# EAGLE board udisk (EAGLE 4.16), part 1 of 2
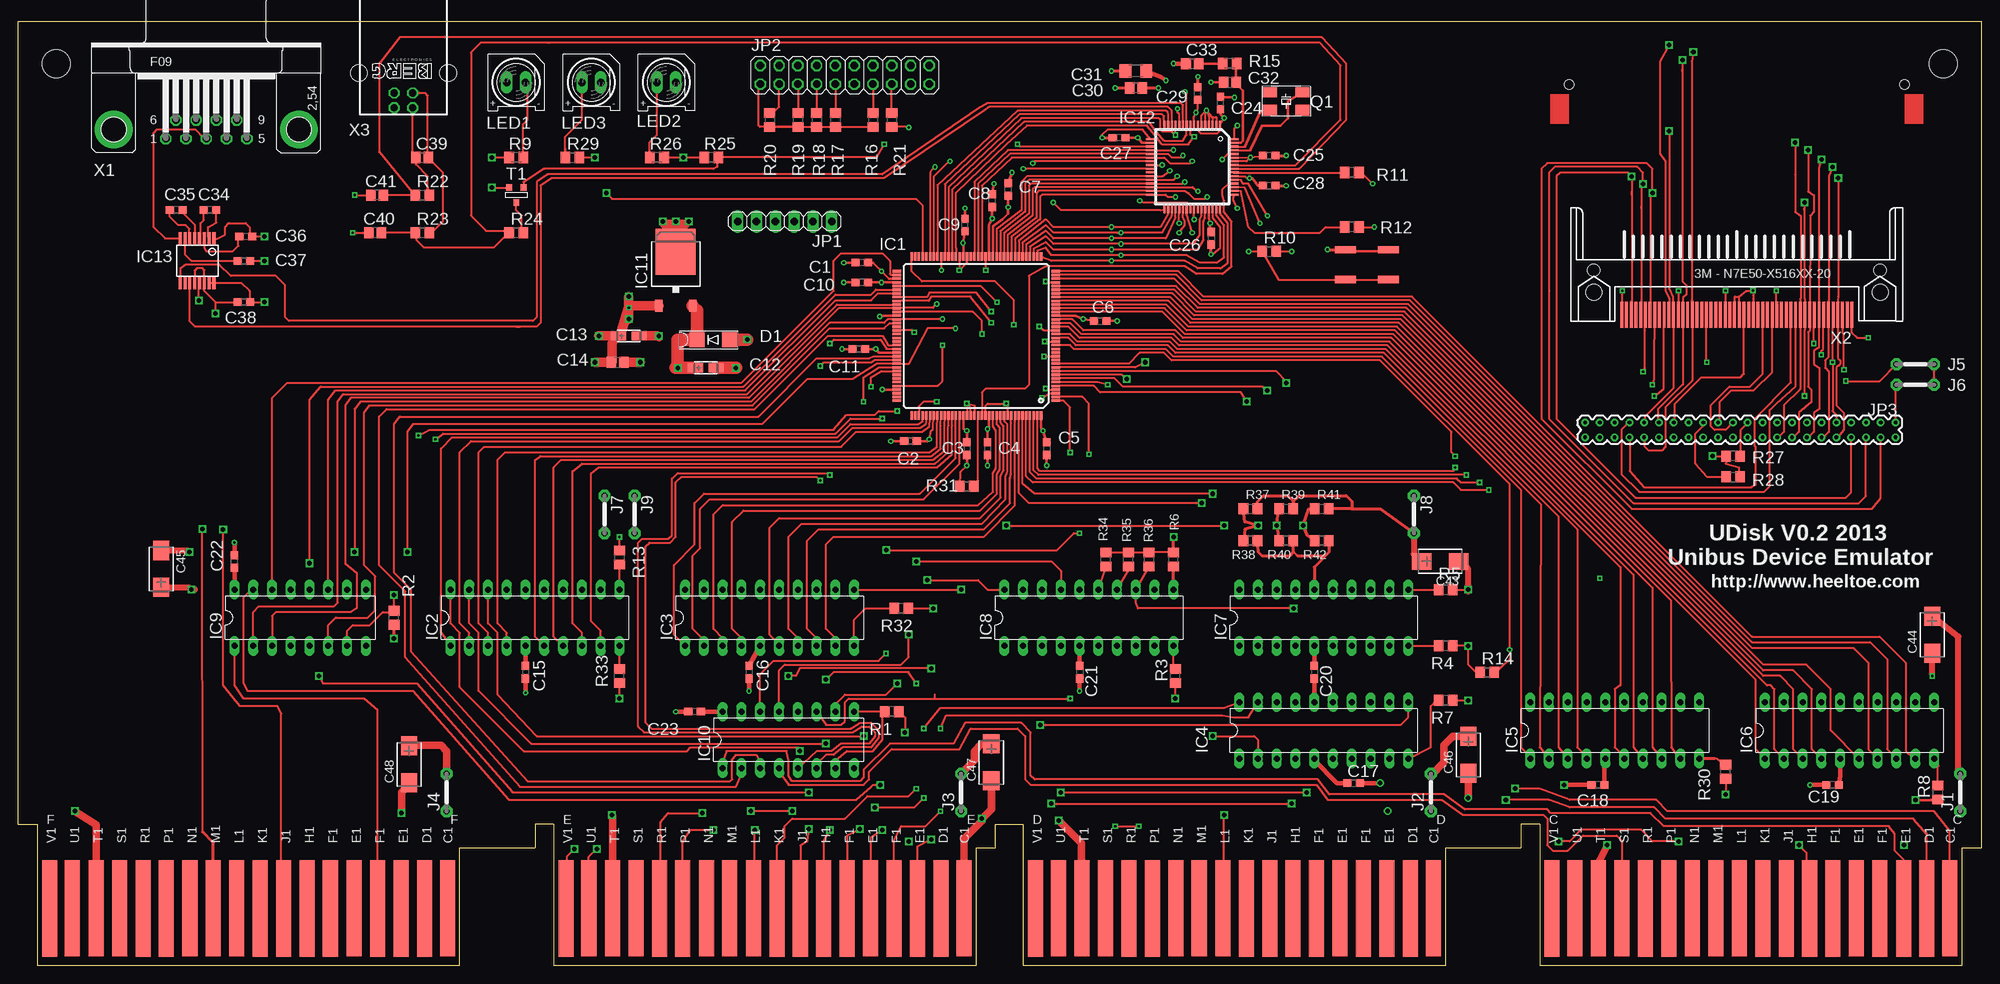
[diagram p7: board, top side]
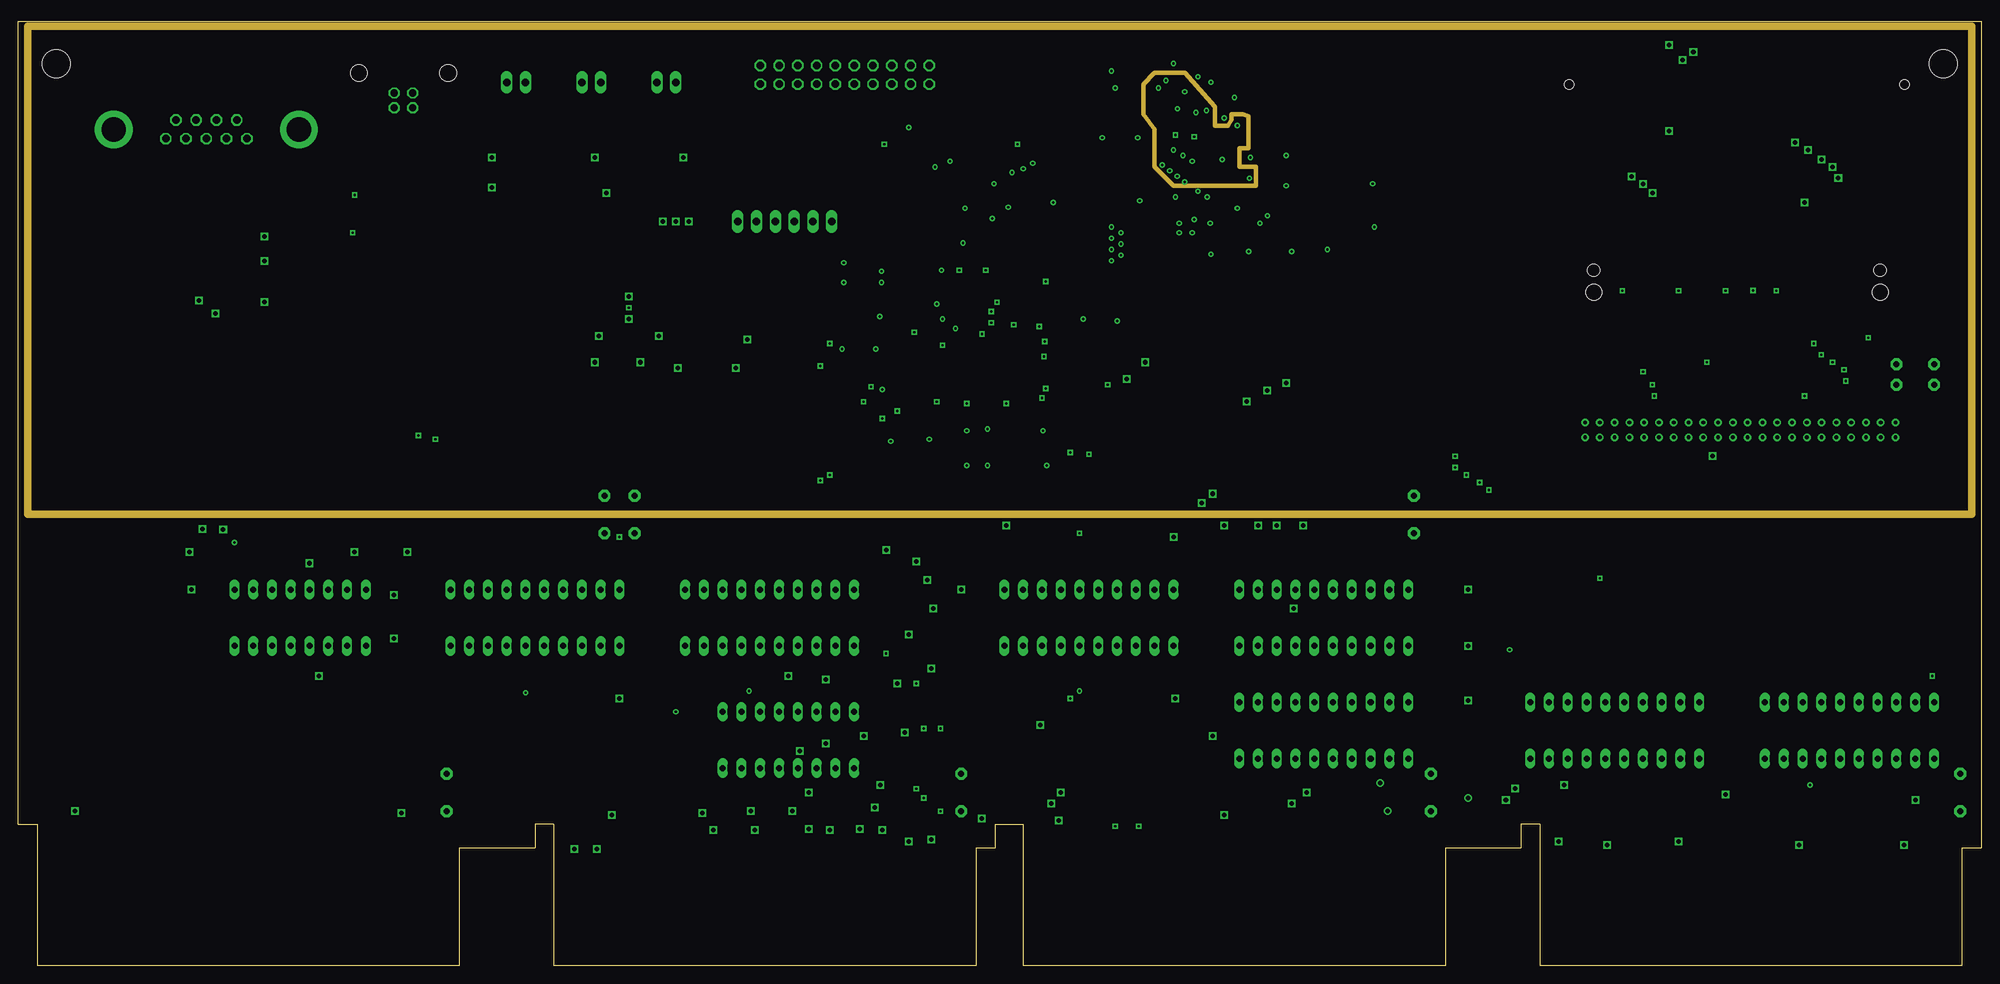
[diagram p8: board, inner layer $+5V]
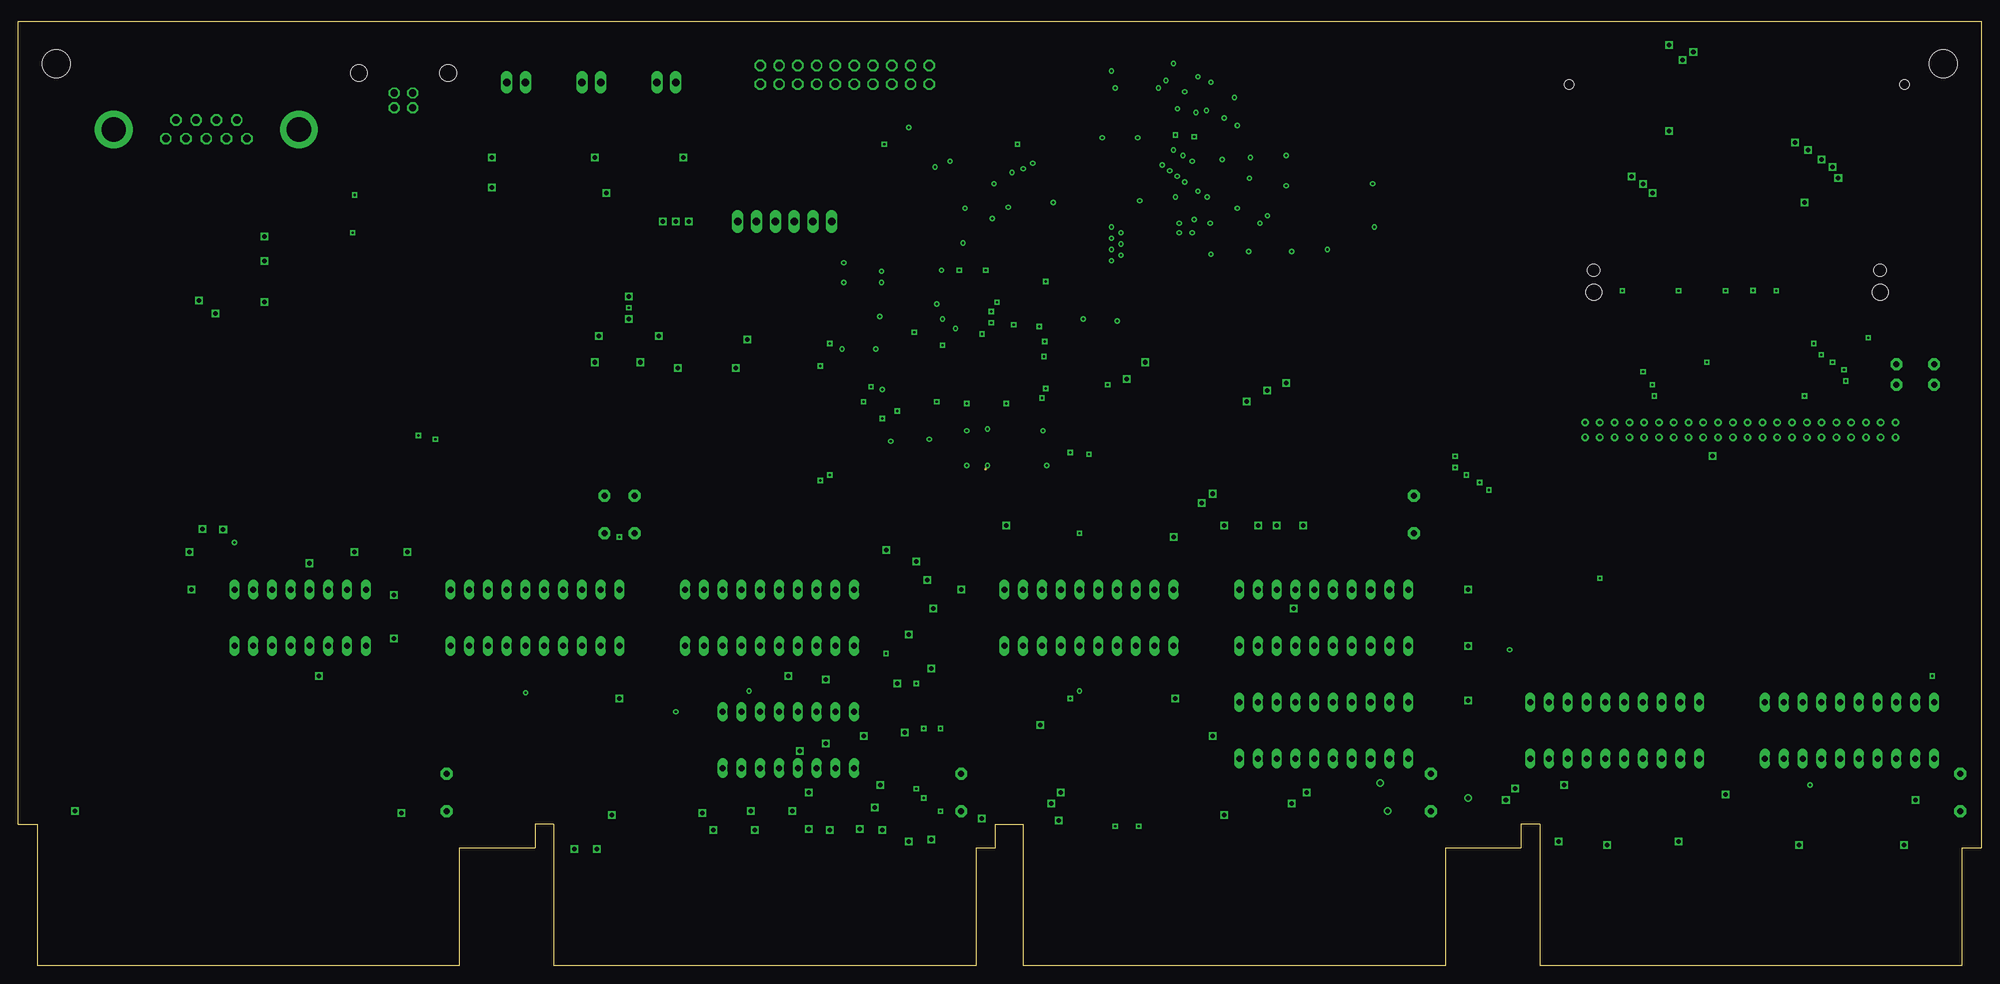
[diagram p9: board, inner layer $GND]
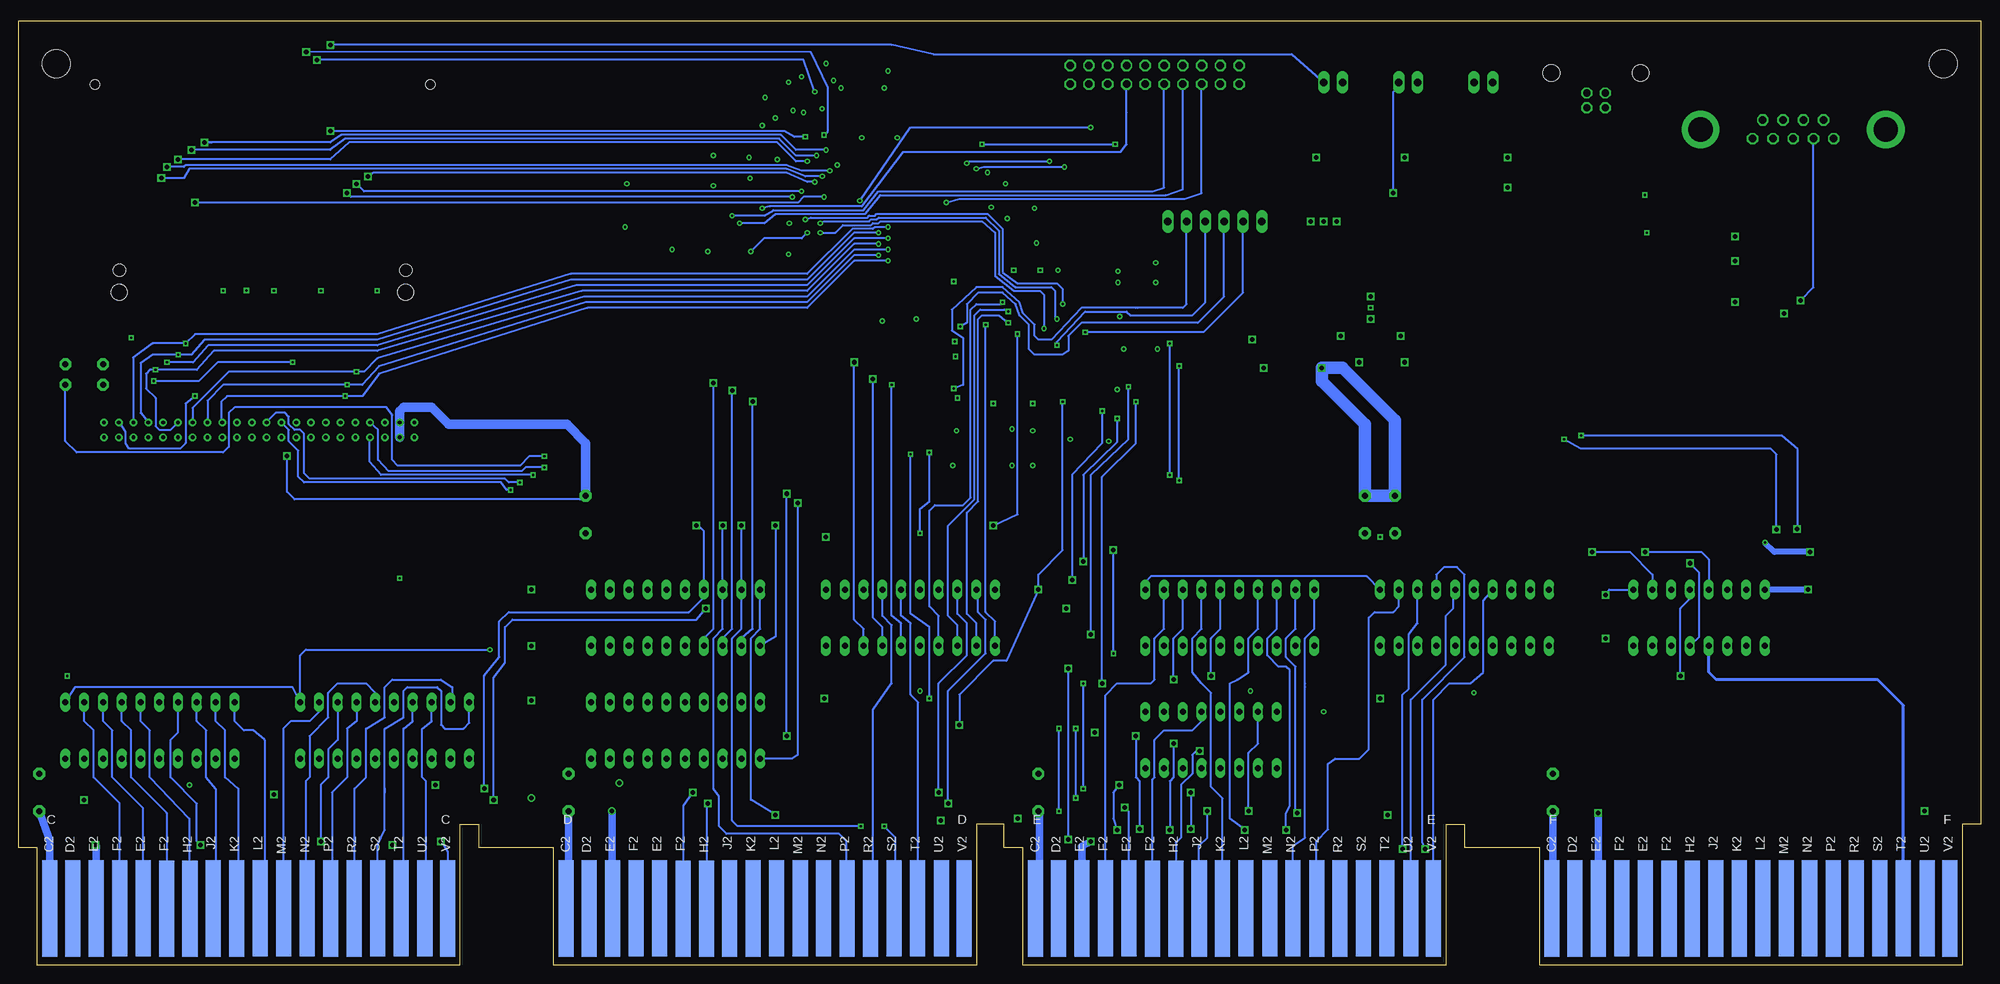
[diagram p10: board, bottom side, seen from below]

Size 265.43 x 127.64 mm. Coordinates in mm from the lower left corner, seen from the top.
Outline: 69.85,15.88 59.69,15.88 59.69,0 2.54,0 2.54,19.05 0,19.05 0,127.64 265.43,127.64 265.43,15.88 262.89,15.88 262.89,0 205.74,0 205.74,19.05 203.2,19.05 203.2,15.88 193.04,15.88 193.04,0 135.89,0 135.89,19.05 132.13,19.05 132.13,15.88 129.54,15.88 129.54,0 72.39,0 72.39,19.05 69.9,19.05 69.9,15.88
Copper layers (1+2*3*4+15+16): Top 0.0356mm / dielectric 0.2007mm / $+5V 0.0356mm / dielectric 0mm / $+3V3 0.0356mm / dielectric 0mm / $vddcore 0.0356mm / dielectric 0.2007mm / $GND 0.0356mm / dielectric 0.2007mm / Bottom 0.0356mm
Design rules "default": minimum track width 10mil, minimum drill 10mil, track to track 7mil, track to pad 6mil, pad to pad 5mil, via to via 7mil, smd to smd 5mil, copper to edge 25mil, drill to drill 8mil, minimum pad ring 10mil, minimum via ring 8mil, stop-mask expansion 4mil, vias tented up to drill 0mil, thermal gap 10mil
Holes 3.81 mm at 5.08,121.92 260.35,121.92

## Footprints (pad centres in the part's own frame; a part is rotated, then mirrored left to right if it is on the bottom)
C0603 = smd 1.1 x 1: 1 -0.85,0; 2 0.85,0
CT3216 = smd 2 x 1.2: + 1.4,0; - -1.4,0
C0805 = smd 1.3 x 1.5: 1 -0.85,0; 2 0.85,0
C1206 = smd 1.6 x 1.8: 1 -1.4,0; 2 1.4,0
CT6032 = smd 2.6 x 2.2: + 2.5,0; - -2.5,0
SMA = smd 2 x 2: 1 -2.2,0; 2 2.2,0
TQ144 = smd 1.2 x 0.35: 1 -10.75,8.75; 2 -10.75,8.25; 3 -10.75,7.75; 4 -10.75,7.25; 5 -10.75,6.75; 6 -10.75,6.25; 7 -10.75,5.75; 8 -10.75,5.25; 9 -10.75,4.75; 10 -10.75,4.25; 11 -10.75,3.75; 12 -10.75,3.25; 13 -10.75,2.75; 14 -10.75,2.25; 15 -10.75,1.75; 16 -10.75,1.25; 17 -10.75,0.75; 18 -10.75,0.25; 19 -10.75,-0.25; 20 -10.75,-0.75; 21 -10.75,-1.25; 22 -10.75,-1.75; 23 -10.75,-2.25; 24 -10.75,-2.75; 25 -10.75,-3.25; 26 -10.75,-3.75; 27 -10.75,-4.25; 28 -10.75,-4.75; 29 -10.75,-5.25; 30 -10.75,-5.75; 31 -10.75,-6.25; 32 -10.75,-6.75; 33 -10.75,-7.25; 34 -10.75,-7.75; 35 -10.75,-8.25; 36 -10.75,-8.75; 73 10.75,-8.75; 74 10.75,-8.25; 75 10.75,-7.75; 76 10.75,-7.25; 77 10.75,-6.75; 78 10.75,-6.25; 79 10.75,-5.75; 80 10.75,-5.25; 81 10.75,-4.75; 82 10.75,-4.25; 83 10.75,-3.75; 84 10.75,-3.25; 85 10.75,-2.75; 86 10.75,-2.25; 87 10.75,-1.75; 88 10.75,-1.25; 89 10.75,-0.75; 90 10.75,-0.25; 91 10.75,0.25; 92 10.75,0.75; 93 10.75,1.25; 94 10.75,1.75; 95 10.75,2.25; 96 10.75,2.75; 97 10.75,3.25; 98 10.75,3.75; 99 10.75,4.25; 100 10.75,4.75; 101 10.75,5.25; 102 10.75,5.75; 103 10.75,6.25; 104 10.75,6.75; 105 10.75,7.25; 106 10.75,7.75; 107 10.75,8.25; 108 10.75,8.75 | smd 0.35 x 1.2: 37 -8.75,-10.75; 38 -8.25,-10.75; 39 -7.75,-10.75; 40 -7.25,-10.75; 41 -6.75,-10.75; 42 -6.25,-10.75; 43 -5.75,-10.75; 44 -5.25,-10.75; 45 -4.75,-10.75; 46 -4.25,-10.75; 47 -3.75,-10.75; 48 -3.25,-10.75; 49 -2.75,-10.75; 50 -2.25,-10.75; 51 -1.75,-10.75; 52 -1.25,-10.75; 53 -0.75,-10.75; 54 -0.25,-10.75; 55 0.25,-10.75; 56 0.75,-10.75; 57 1.25,-10.75; 58 1.75,-10.75; 59 2.25,-10.75; 60 2.75,-10.75; 61 3.25,-10.75; 62 3.75,-10.75; 63 4.25,-10.75; 64 4.75,-10.75; 65 5.25,-10.75; 66 5.75,-10.75; 67 6.25,-10.75; 68 6.75,-10.75; 69 7.25,-10.75; 70 7.75,-10.75; 71 8.25,-10.75; 72 8.75,-10.75; 109 8.75,10.75; 110 8.25,10.75; 111 7.75,10.75; 112 7.25,10.75; 113 6.75,10.75; 114 6.25,10.75; 115 5.75,10.75; 116 5.25,10.75; 117 4.75,10.75; 118 4.25,10.75; 119 3.75,10.75; 120 3.25,10.75; 121 2.75,10.75; 122 2.25,10.75; 123 1.75,10.75; 124 1.25,10.75; 125 0.75,10.75; 126 0.25,10.75; 127 -0.25,10.75; 128 -0.75,10.75; 129 -1.25,10.75; 130 -1.75,10.75; 131 -2.25,10.75; 132 -2.75,10.75; 133 -3.25,10.75; 134 -3.75,10.75; 135 -4.25,10.75; 136 -4.75,10.75; 137 -5.25,10.75; 138 -5.75,10.75; 139 -6.25,10.75; 140 -6.75,10.75; 141 -7.25,10.75; 142 -7.75,10.75; 143 -8.25,10.75; 144 -8.75,10.75
DIL20 = drill 0.813 long: 1 -11.43,-3.81; 2 -8.89,-3.81; 3 -6.35,-3.81; 4 -3.81,-3.81; 5 -1.27,-3.81; 6 1.27,-3.81; 7 3.81,-3.81; 8 6.35,-3.81; 9 8.89,-3.81; 10 11.43,-3.81; 11 11.43,3.81; 12 8.89,3.81; 13 6.35,3.81; 14 3.81,3.81; 15 1.27,3.81; 16 -1.27,3.81; 17 -3.81,3.81; 18 -6.35,3.81; 19 -8.89,3.81; 20 -11.43,3.81
DIL16 = drill 0.813 long: 1 -8.89,-3.81; 2 -6.35,-3.81; 3 -3.81,-3.81; 4 -1.27,-3.81; 5 1.27,-3.81; 6 3.81,-3.81; 7 6.35,-3.81; 8 8.89,-3.81; 9 8.89,3.81; 10 6.35,3.81; 11 3.81,3.81; 12 1.27,3.81; 13 -1.27,3.81; 14 -3.81,3.81; 15 -6.35,3.81; 16 -8.89,3.81
TO252 = smd 1 x 1.6: 1 -2.28,-4.8; 2 2.28,-4.8 | smd 5.4 x 6.2: 3 0,2.5
LQFP64 = smd 1.1 x 0.285: 1 -5.7,3.75; 2 -5.7,3.25; 3 -5.7,2.75; 4 -5.7,2.25; 5 -5.7,1.75; 6 -5.7,1.25; 7 -5.7,0.75; 8 -5.7,0.25; 9 -5.7,-0.25; 10 -5.7,-0.75; 11 -5.7,-1.25; 12 -5.7,-1.75; 13 -5.7,-2.25; 14 -5.7,-2.75; 15 -5.7,-3.25; 16 -5.7,-3.75; 33 5.7,-3.75; 34 5.7,-3.25; 35 5.7,-2.75; 36 5.7,-2.25; 37 5.7,-1.75; 38 5.7,-1.25; 39 5.7,-0.75; 40 5.7,-0.25; 41 5.7,0.25; 42 5.7,0.75; 43 5.7,1.25; 44 5.7,1.75; 45 5.7,2.25; 46 5.7,2.75; 47 5.7,3.25; 48 5.7,3.75 | smd 0.285 x 1.1: 17 -3.75,-5.7; 18 -3.25,-5.7; 19 -2.75,-5.7; 20 -2.25,-5.7; 21 -1.75,-5.7; 22 -1.25,-5.7; 23 -0.75,-5.7; 24 -0.25,-5.7; 25 0.25,-5.7; 26 0.75,-5.7; 27 1.25,-5.7; 28 1.75,-5.7; 29 2.25,-5.7; 30 2.75,-5.7; 31 3.25,-5.7; 32 3.75,-5.7; 49 3.75,5.7; 50 3.25,5.7; 51 2.75,5.7; 52 2.25,5.7; 53 1.75,5.7; 54 1.25,5.7; 55 0.75,5.7; 56 0.25,5.7; 57 -0.25,5.7; 58 -0.75,5.7; 59 -1.25,5.7; 60 -1.75,5.7; 61 -2.25,5.7; 62 -2.75,5.7; 63 -3.25,5.7; 64 -3.75,5.7
TSSOP-16 = smd 0.42 x 1.78: 1 -2.3,-2.975; 2 -1.65,-2.975; 3 -1,-2.975; 4 -0.35,-2.975; 5 0.3,-2.975; 6 0.95,-2.975; 7 1.6,-2.975; 8 2.25,-2.975; 9 2.25,2.975; 10 1.6,2.975; 11 0.95,2.975; 12 0.3,2.975; 13 -0.35,2.975; 14 -1,2.975; 15 -1.65,2.975; 16 -2.3,2.975
05 = drill 0.813 pad 1.6 octagon: 1 -2.54,0; 2 2.54,0
1X06 = drill 1.016 long: 1 -6.35,0; 2 -3.81,0; 3 -1.27,0; 4 1.27,0; 5 3.81,0; 6 6.35,0
2X10 = drill 1.016 octagon: 1 -11.43,-1.27; 2 -11.43,1.27; 3 -8.89,-1.27; 4 -8.89,1.27; 5 -6.35,-1.27; 6 -6.35,1.27; 7 -3.81,-1.27; 8 -3.81,1.27; 9 -1.27,-1.27; 10 -1.27,1.27; 11 1.27,-1.27; 12 1.27,1.27; 13 3.81,-1.27; 14 3.81,1.27; 15 6.35,-1.27; 16 6.35,1.27; 17 8.89,-1.27; 18 8.89,1.27; 19 11.43,-1.27; 20 11.43,1.27
2X22 = drill 0.508 round: 1 -24,-1; 2 -24,1; 3 -22,-1; 4 -22,1; 5 -20,-1; 6 -20,1; 7 -18,-1; 8 -18,1; 9 -16,-1; 10 -16,1; 11 -14,-1; 12 -14,1; 13 -12,-1; 14 -12,1; 15 -10,-1; 16 -10,1; 17 -8,-1; 18 -8,1; 19 -6,-1; 20 -6,1; 21 -4,-1; 22 -4,1; 23 -2,-1; 24 -2,1; 25 0,-1; 26 0,1; 27 2,-1; 28 2,1; 29 4,-1; 30 4,1; 31 6,-1; 32 6,1; 33 8,-1; 34 8,1; 35 10,-1; 36 10,1; 37 12,-1; 38 12,1; 39 14,-1; 40 14,1; 41 16,-1; 42 16,1; 43 18,-1; 44 18,1
Q62902-B156 = drill 1.016 long: A -1.27,0; K 1.27,0
SM406 = smd 1.9 x 1.4: 1 -2.2,-1.2; 2 2.2,-1.2; 3 2.2,1.2; 4 -2.2,1.2
R0805 = smd 1.3 x 1.5: 1 -0.95,0; 2 0.95,0
M0805 = smd 1.3 x 1.6: 1 -0.95,0; 2 0.95,0
KSC241J = smd 2.8 x 1: P1 -2.9,2; P2 2.9,2; P3 -2.9,-2; P4 2.9,-2
SOT-23 = smd 0.787 x 0.889: 1 0.025,-1.016; 2 -0.94,1.016; 3 0.991,1.016
EDGE-CON8 = smd 2.032 x 13.017: CA1 261.223,7.709; CB1 258.118,7.684; CC1 254.956,7.684; CD1 251.765,7.684; CE1 248.59,7.693; CF1 245.389,7.668; CH1 242.24,7.668; CJ1 239.09,7.668; CK1 235.915,7.668; CL1 232.74,7.693; CM1 229.54,7.693; CN1 226.39,7.693; CP1 223.19,7.668; CR1 220.04,7.668; CS1 216.865,7.693; CT1 213.69,7.693; CU1 210.49,7.693; CV1 207.404,7.668; DA1 191.373,7.709; DB1 188.268,7.684; DC1 185.106,7.684; DD1 181.915,7.684; DE1 178.74,7.693; DF1 175.539,7.668; DH1 172.39,7.668; DJ1 169.24,7.668; DK1 166.065,7.668; DL1 162.89,7.693; DM1 159.69,7.693; DN1 156.54,7.693; DP1 153.34,7.668; DR1 150.19,7.668; DS1 147.015,7.693; DT1 143.84,7.693; DU1 140.64,7.693; DV1 137.554,7.668; EA1 127.873,7.709; EB1 124.768,7.684; EC1 121.606,7.684; ED1 118.415,7.684; EE1 115.24,7.693; EF1 112.039,7.668; EH1 108.89,7.668; EJ1 105.74,7.668; EK1 102.565,7.668; EL1 99.39,7.693; EM1 96.19,7.693; EN1 93.04,7.693; EP1 89.84,7.668; ER1 86.69,7.668; ES1 83.515,7.693; ET1 80.34,7.693; EU1 77.14,7.693; EV1 74.054,7.668; FA1 58.023,7.709; FB1 54.918,7.684; FC1 51.756,7.684; FD1 48.565,7.684; FE1 45.39,7.693; FF1 42.189,7.668; FH1 39.04,7.668; FJ1 35.89,7.668; FK1 32.715,7.668; FL1 29.54,7.693; FM1 26.34,7.693; FN1 23.19,7.693; FP1 19.99,7.668; FR1 16.84,7.668; FS1 13.665,7.693; FT1 10.49,7.693; FU1 7.29,7.693; FV1 4.204,7.668 | smd 2.032 x 13.017 bottom: CA2 261.223,7.69; CB2 258.102,7.668; CC2 254.94,7.668; CD2 251.765,7.693; CE2 248.59,7.693; CF2 245.389,7.642; CH2 242.24,7.642; CJ2 239.09,7.668; CK2 235.915,7.668; CL2 232.74,7.693; CM2 229.54,7.693; CN2 226.39,7.693; CP2 223.19,7.668; CR2 220.04,7.668; CS2 216.865,7.693; CT2 213.69,7.693; CU2 210.464,7.693; CV2 207.404,7.668; DA2 191.373,7.69; DB2 188.252,7.668; DC2 185.09,7.668; DD2 181.915,7.693; DE2 178.74,7.693; DF2 175.539,7.642; DH2 172.39,7.642; DJ2 169.24,7.668; DK2 166.065,7.668; DL2 162.89,7.693; DM2 159.69,7.693; DN2 156.54,7.693; DP2 153.34,7.668; DR2 150.19,7.668; DS2 147.015,7.693; DT2 143.84,7.693; DU2 140.614,7.693; DV2 137.554,7.668; EA2 127.873,7.69; EB2 124.752,7.668; EC2 121.59,7.668; ED2 118.415,7.693; EE2 115.24,7.693; EF2 112.039,7.642; EH2 108.89,7.642; EJ2 105.74,7.668; EK2 102.565,7.668; EL2 99.39,7.693; EM2 96.19,7.693; EN2 93.04,7.693; EP2 89.84,7.668; ER2 86.69,7.668; ES2 83.515,7.693; ET2 80.34,7.693; EU2 77.114,7.693; EV2 74.054,7.668; FA2 58.023,7.69; FB2 54.902,7.668; FC2 51.74,7.668; FD2 48.565,7.693; FE2 45.39,7.693; FF2 42.189,7.642; FH2 39.04,7.642; FJ2 35.89,7.668; FK2 32.715,7.668; FL2 29.54,7.693; FM2 26.34,7.693; FN2 23.19,7.693; FP2 19.99,7.668; FR2 16.84,7.668; FS2 13.665,7.693; FT2 10.49,7.693; FU2 7.264,7.693; FV2 4.204,7.668
F09HP = drill 1.016 octagon: 1 -5.486,-1.27; 2 -2.743,-1.27; 3 0,-1.27; 4 2.743,-1.27; 5 5.486,-1.27; 6 -4.115,1.27; 7 -1.372,1.27; 8 1.372,1.27; 9 4.115,1.27 | drill 3.302 pad 5.08 round: G1 -12.522,0; G2 12.522,0
N7E50516 = smd 0.4 x 3.5: 1 -15.557,6.015; 2 -14.287,6.015; 3 -13.018,6.015; 4 -11.748,6.015; 5 -10.477,6.015; 6 -9.207,6.015; 7 -7.938,6.015; 8 -6.668,6.015; 9 -5.397,6.015; 10 -4.128,6.015; 11 -2.857,6.015; 12 -1.587,6.015; 13 -0.318,6.015; 14 0.953,6.015; 15 2.223,6.015; 16 3.493,6.015; 17 4.763,6.015; 18 6.032,6.015; 19 7.303,6.015; 20 8.572,6.015; 21 9.842,6.015; 22 11.113,6.015; 23 12.383,6.015; 24 13.652,6.015; 25 14.922,6.015; 26 -14.922,6.015; 27 -13.652,6.015; 28 -12.383,6.015; 29 -11.113,6.015; 30 -9.842,6.015; 31 -8.572,6.015; 32 -7.303,6.015; 33 -6.032,6.015; 34 -4.763,6.015; 35 -3.493,6.015; 36 -2.223,6.015; 37 -0.953,6.015; 38 0.318,6.015; 39 1.587,6.015; 40 2.857,6.015; 41 4.128,6.015; 42 5.397,6.015; 43 6.668,6.015; 44 7.938,6.015; 45 9.207,6.015; 46 10.477,6.015; 47 11.748,6.015; 48 13.018,6.015; 49 14.287,6.015; 50 15.557,6.015 | hole 1.7: -19.37,0; 19.37,0 | hole 2.2: -19.37,3; 19.37,3 | hole 1.3: 22.7,-25.1; -22.7,-25.1
PN61729 = drill 0.95 octagon: 1 1.25,4.71; 2 -1.25,4.71; 3 -1.25,2.71; 4 1.25,2.71 | hole 2.3: -6.02,0; 6.02,0

## Placement (x,y rotation side)
C1  0.1uf  [C0603]  114.05,95 180 top
C2  0.1uf  [C0603]  120.65,70.87 180 top
C3  0.1uf  [C0603]  128.27,69.85 270 top
C4  0.1uf  [C0603]  131.06,69.85 270 top
C5  0.1uf  [C0603]  139.06,69.85 270 top
C6  0.1uf  [C0603]  146.3,87.12 0 top
C7  0.1uf  [C0603]  133.86,104.9 90 top
C8  0.1uf  [C0603]  131.7,103.38 90 top
C9  0.1uf  [C0603]  128.02,100.08 90 top
C10  0.1uf  [C0603]  114.05,92.33 180 top
C11  0.1uf  [C0603]  113.67,83.31 180 top
C12  10uf  [CT3216]  92.96,80.77 180 top
C13  4.7uf  [CT3216]  82.55,85.09 180 top
C14  0.01uf  [C0805]  81.03,81.53 0 top
C15  0.1uf  [C0603]  68.58,39.62 270 top
C16  0.1uf  [C0603]  98.81,39.62 270 top
C17  0.1uf  [C0603]  180.59,24.64 0 top
C18  0.1uf  [C0603]  213.61,24.38 180 top
C19  0.1uf  [C0603]  245.36,24.38 180 top
C20  0.1uf  [C0603]  175.26,39.62 270 top
C21  0.1uf  [C0603]  143.51,39.62 270 top
C22  0.1uf  [C0603]  29.21,54.61 90 top
C23  0.1uf  [C0603]  91.44,34.29 180 top
C24  0.1uf  [C0603]  162.56,116.59 90 top
C25  0.1uf  [C0603]  169.16,109.47 0 top
C26  0.1uf  [C0603]  161.29,98.3 270 top
C27  0.1uf  [C0603]  148.84,111.89 180 top
C28  0.1uf  [C0603]  169.16,105.41 0 top
C29  0.1uf  [C0603]  159.51,117.86 90 top
C30  1000pf  [C0805]  151.13,118.62 180 top
C31  2.2uf  [C1206]  151.13,120.9 180 top
C32  100pf  [C0805]  163.83,119.38 0 top
C33  0.01uf  [C0805]  158.75,121.92 0 top
C34  0.1uf  [C0603]  25.91,102.11 180 top
C35  0.1uf  [C0603]  21.34,102.11 180 top
C36  0.1uf  [C0603]  30.73,98.55 0 top
C37  0.1uf  [C0603]  30.48,95.25 0 top
C38  0.1uf  [C0603]  30.48,89.66 180 top
C39  33pf  [C0805]  54.61,109.22 0 top
C40  15pf  [C0805]  48.26,99.06 180 top
C41  15pf  [C0805]  48.51,104.14 180 top
C43  22uf, 16v  [CT6032]  192.28,54.61 180 top
C44  22uf, 16v  [CT6032]  258.83,44.7 90 top
C45  10uf, 16v  [CT6032]  19.3,53.59 270 top
C46  10uf, 16v  [CT6032]  196.09,28.45 90 top
C47  10uf, 16v  [CT6032]  131.57,27.43 90 top
C48  10uf, 16v  [CT6032]  52.83,27.18 90 top
D1  TVS 7.5V  [SMA]  93.98,84.58 0 top
IC1  [TQ144]  129.54,85.09 180 top
IC2  DS3862N  [DIL20]  69.85,46.99 0 top
IC3  DS3862N  [DIL20]  101.6,46.99 0 top
IC4  DS3862N  [DIL20]  176.53,31.75 0 top
IC5  DS3862N  [DIL20]  215.9,31.75 0 top
IC6  DS3862N  [DIL20]  247.65,31.75 0 top
IC7  DS3862N  [DIL20]  176.53,46.99 0 top
IC8  DS3862N  [DIL20]  144.78,46.99 0 top
IC9  DS8641N  [DIL16]  38.1,46.99 0 top
IC10  DS8641N  [DIL16]  104.14,30.48 0 top
IC11  LP8345  [TO252]  88.9,93.98 0 top
IC12  [LQFP64]  158.75,107.95 270 top
IC13  MAX3221CPWRG  [TSSOP-16]  24.13,95.25 180 top
J1  J5MM  [05]  262.64,23.37 90 top
J2  J5MM  [05]  191.01,23.37 90 top
J3  J5MM  [05]  127.51,23.37 90 top
J4  J5MM  [05]  57.91,23.37 90 top
J5  J5MM  [05]  256.54,81.28 180 top
J6  J5MM  [05]  256.54,78.49 180 top
J7  J5MM  [05]  79.25,60.96 270 top
J8  J5MM  [05]  188.72,60.96 270 top
J9  J5MM  [05]  83.31,60.96 270 top
JP1  [1X06]  103.63,100.58 180 top
JP2  [2X10]  111.76,120.4 0 top
JP3  [2X22]  229.87,72.39 180 top
LED1  GREEN  [Q62902-B156]  67.31,119.38 0 top
LED2  yellow  [Q62902-B156]  87.63,119.38 0 top
LED3  [Q62902-B156]  77.47,119.38 0 top
Q1  18.432Mhz  [SM406]  171.45,116.84 180 top
R1  0 ohm  [R0805]  118.11,34.29 180 top
R2  0 ohm  [R0805]  50.8,46.99 90 top
R3  0 ohm  [R0805]  156.46,39.12 90 top
R4  0 ohm  [R0805]  193.04,43.18 180 top
R5  0 ohm  [R0805]  193.04,50.8 0 top
R6  0 ohm  [R0805]  156.21,54.86 90 top
R7  1k  [R0805]  193.04,35.81 180 top
R8  1k  [R0805]  259.59,23.37 90 top
R9  75  [M0805]  67.31,109.22 0 top
R10  10k  [R0805]  169.16,96.52 0 top
R11  0 ohm  [R0805]  180.34,107.19 180 top
R12  0 ohm  [R0805]  180.34,99.82 180 top
R13  10k  [R0805]  81.28,55.12 270 top
R14  10k  [R0805]  198.63,39.62 0 top
R15  499  [M0805]  163.83,121.92 0 top
R16  47.5k  [R0805]  115.57,114.3 270 top
R17  47.5k  [R0805]  110.49,114.3 270 top
R18  47.5k  [R0805]  107.95,114.3 270 top
R19  47.5k  [R0805]  105.41,114.3 270 top
R20  47.5k  [R0805]  101.6,114.3 270 top
R21  0 ohm  [R0805]  118.11,114.3 270 top
R22  27  [R0805]  54.61,104.14 0 top
R23  27  [R0805]  54.61,99.06 0 top
R24  1.5k  [R0805]  67.31,99.06 0 top
R25  100k  [R0805]  93.73,109.22 180 top
R26  1k  [M0805]  86.36,109.22 0 top
R27  10k  [R0805]  231.9,66.04 0 top
R28  10k  [R0805]  231.9,68.83 180 top
R29  140  [R0805]  74.93,109.22 0 top
R30  1k  [R0805]  230.89,26.16 90 top
R31  0 ohm  [R0805]  128.27,64.77 0 top
R32  1k  [R0805]  119.38,48.26 180 top
R33  1k  [R0805]  81.28,39.12 90 top
R34  178  [R0805]  147.07,54.86 90 top
R35  178  [R0805]  150.11,54.86 90 top
R36  178  [R0805]  152.91,54.86 90 top
R37  [R0805]  166.62,61.72 0 top
R38  [R0805]  166.62,57.4 180 top
R39  [R0805]  171.45,61.72 0 top
R40  [R0805]  171.45,57.4 180 top
R41  [R0805]  176.28,61.72 0 top
R42  [R0805]  176.28,57.4 180 top
S1  [KSC241J]  182.37,94.74 0 top
T1  [SOT-23]  67.31,104.14 0 top
U$1  [EDGE-CON8]  0,0 0 top
X1  [F09HP]  25.4,113.03 0 top
X2  [N7E50516]  232.41,93.98 180 top
X3  [PN61729]  52.07,120.65 180 top

## Tracks (layer width: path | path; a pad name or v marks a point on that pad's centre or on a via)
+3V3  (via drill 0.3, 0.3 pad 0.3, 0.61)
  Top 0.254: IC12.59 v166.62,109.22 | IC12.58 166.1,108.7 v166.62,109.22 | v166.62,109.22 C25.1 | 163.05,114.54 IC12.1 162.5,113.6 162.56,113.54 162.56,112.9 162.18,112.52 159.89,112.52 159.5,112.92 IC12.7 | v123.19,71.12 123.44,72.26 123.66,72.48 IC1.115 | 26.67,92.28 IC13.16 | 26.67,92.28 30.15,92.28 31.24,91.19 31.24,89.66 C38.1 v33.27,89.66 | v64.01,105.16 T1.2 | v77.98,109.22 77.98,108.97 77.72,109.22 R29.2 75.69,109.22 | R26.2 v89.92,109.22 92.96,109.22 | X2.36 234.63,90.11 234.61,90.59 v234.61,91.24 234.7,91.19 233.68,91.19 232.66,90.42 | 224.54,88.14 v224.54,91.19 | 224.54,88.14 224.47,88.08 X2.44 | 224.54,88.14 224.54,87.38 | 26.67,92.28 26.67,92.2 26.6,92.28 IC13.15 | R20.2 101.6,113.28 101.67,113.35 | R19.2 101.67,113.35 | R19.2 R18.2 | R20.2 100.26,113.35 100.08,113.54 100.08,119.13 JP2.1 | R20.2 101.67,113.35 | 101.41,113.35 R20.2 | 101.41,113.35 R19.2 | 101.35,113.28 101.41,113.35 | R16.2 115.57,113.28 115.5,113.35 R17.2 | R18.2 R17.2 | R17.2 110.49,113.28 110.42,113.35 R18.2 | R11.1 181.61,107.19 v183.13,105.66 | 169.93,96.52 R10.2 v172.21,96.52 | R12.1 v183.39,99.82 | 232.66,90.42 X2.13 | 232.66,90.42 232.16,90.42 X2.38
  Top 0.305: IC12.45 161,101 v161.16,100.33 161.16,99.57 161.29,99.44 C26.1 | IC12.18 151.94,111.2 v151.38,111.89 150.24,111.89 149.69,111.93 C27.1 | 163.05,114.54 v163.07,114.55 162.56,115.06 C24.1 | IC1.76 115.71,92.34 v116.71,92.33 C10.1 | IC1.95 116.37,82.84 v115.95,83.31 C11.1 | IC1.75 117.73,92.84 v116.71,93.85 115.57,95 C1.1 114.81,95 | IC1.58 127.79,97.89 v127.76,97.66 C9.1 | C8.1 v131.7,100.97 131.29,100.1 IC1.51 | IC1.50 131.79,99.91 133.1,100.84 133.86,101.6 v133.86,102.49 C7.1 | IC1.24 142.96,87.84 v144.02,87.38 C6.1 | IC1.123 127.79,72.55 v128.27,72.26 C3.1 | IC1.130 131.29,72.55 v131.06,72.52 C4.1 | v123.19,71.12 122.94,70.87 C2.1 | IC1.144 138.29,72.66 v138.56,72.26 C5.1
  Top 0.406: R25.2 92.96,109.22 92.96,108.97
  Top 1.016: v82.55,88.9 82.83,89.18 | 81.53,85.6 81.28,85.09 C13.+ 81.15,84.97 80.26,84.07 | C14.1 80.26,81.79
  Top 1.27: 82.83,89.18 IC11.1 | 81.53,85.6 v82.55,88.9 | 80.26,81.79 80.26,84.07 | v78.49,85.09 81.03,85.09 | v77.98,81.53 80.26,81.53 | v82.55,87.38 v82.55,90.42
+5V  (via drill 0.3 pad 0.3, 0.6, 0.61)
  Top 0.254: 172.47,61.72 R39.2 172.4,62.67 | R34.2 150.05,55.81 150.11,55.88 R35.2 152.84,55.81 152.91,55.88 | 152.91,55.88 R36.2 | 152.91,55.88 156.21,55.88
  Top 0.406: v156.21,57.91 156.21,55.88 R6.2 | R37.2 167.57,62.67 168.4,63.5 171.7,63.5 172.47,62.74 172.47,61.72 | 172.4,62.67 173.23,63.5 179.58,63.5 180.34,62.74 180.34,61.72 | 180.34,61.72 R41.2 | J8.2 184.15,61.72 180.34,61.72
  Top 0.61: C19.1 246.38,25.65 IC6.5 | C16.1 IC3.5 | 29.38,53.76 29.46,53.85 | 29.38,53.76 C22.1 | IC9.16 29.21,53.59 29.38,53.76 | 95.5,34.29 IC10.16 C23.1 | C21.1 IC8.5 | C20.1 IC7.5 | 68.58,43.43 IC2.5 C15.1 | 214.46,28.11 IC5.5 | C18.1 214.46,28.11 | 214.46,28.11 214.38,28.19 | IC4.5 175.26,27.69 178.31,24.64 C17.1 179.83,24.64
  Top 0.813: 23.84,50.84 v23.37,50.8 23.07,51.09 C45.+ | C43.+ 188.72,55.63 J8.2 | C44.+ 262.38,44.45 262.38,26.16 J1.2
  Top 1.016: C46.+ 194.02,30.95 192.79,29.72 192.79,27.43 191.01,25.65 J2.2 | C47.+ 130.26,29.93 129.29,28.96 129.29,27.69 J3.2 | J4.2 57.91,28.96 57.15,29.72 53.09,29.72 53.05,29.68 C48.+
  Bottom 0.813: v23.37,50.8 IC9.16
  other vias: 213.87,52.32
+5V_IDE  (via drill 0.61)
  Top 0.254: R27.2 232.85,66.23 232.92,66.29 232.66,66.55 232.66,67.31 230.89,67.82 231.14,68.58 R28.2 | R28.2 v229.11,68.83 R28.2
  Bottom 0.254: J8.1 188.98,63.5 189.48,62.99 228.09,62.99 229.11,64.01 v229.11,68.83
  Bottom 1.27: J8.1 188.72,70.61 191.26,73.15 207.26,73.15 209.55,75.44 213.36,75.44 213.87,74.93 213.87,73.41 | JP3.42 213.87,71.38 213.87,71.37 213.87,73.41 | 213.87,73.41 213.87,73.4 JP3.41
+5V_TRACE  (via drill 0.61)
  Top 1.016: 91.78,88.56 91.18,89.16
  Top 1.676: v89.15,80.77 89.15,84.58 D1.1 91.78,88.56 | v89.15,80.77 C12.+ | 91.18,89.16 IC11.2 | v89.15,80.77 88.9,80.77
  Bottom 1.676: J7.1 J9.1 83.31,73.15 89.15,78.99 v89.15,80.77 86.36,80.77 79.25,73.66 J7.1
A00_L  (via drill 0.61)
  Top 0.254: IC2.20 58.42,46.23 59.69,44.96 59.69,37.59 68.33,28.96 90.42,28.96 90.93,29.46 105.41,29.46 105.66,29.21 v105.66,28.96
  Bottom 0.254: U$1.EH2 108.89,16.59 108.2,17.27 108.2,24.38 106.68,25.91 106.68,28.45 106.17,28.96 v105.66,28.96
A01_L  (via drill 0.61)
  Top 0.254: IC2.19 60.96,46.23 62.23,44.96 62.23,37.08 69.34,29.97 v109.22,29.97 | U$1.EH1 108.89,16.84 v109.7,18.26
  Bottom 0.254: v109.7,18.26 109.73,18.29 109.73,24.89 109.22,25.4 v109.22,29.97
A02_L  (via drill 0.61)
  Top 0.254: IC2.18 63.5,46.23 64.77,44.96 64.77,36.58 70.1,30.99 v114.3,30.99 | U$1.EF1 112.04,17.5 v113.79,18.4
  Bottom 0.254: v113.79,18.4 113.79,19.3 113.79,24.89 114.3,25.4 v114.3,30.99
A03_L
  Bottom 0.254: U$1.EV2 74.05,35.93 71.88,38.1 69.09,38.1 67.31,39.62 67.31,49.28 IC2.17 65.79,51.05
A04_L
  Bottom 0.254: U$1.EU2 77.11,35.92 72.39,40.64 72.39,47.24 71.37,48.26 71.37,50.29 71.12,50.55 IC2.15
A05_L  (via drill 0.61)
  Top 0.254: U$1.EV1 74.17,14.73 v75.18,15.75 | IC2.14 73.91,50.8
  Bottom 0.254: v75.18,15.75 75.58,16.65 75.58,34.94 75.58,35.93 69.85,41.66 69.85,52.83 70.87,53.85 72.64,53.85 73.66,52.83 IC2.14
A06_L  (via drill 0.61)
  Top 0.254: U$1.EU1 77.14,14.66 v78.23,15.75
  Bottom 0.254: v78.23,15.75 78.23,36.58 77.39,37.41 77.39,44.78 76.2,46.23 IC2.13
A07_L
  Bottom 0.254: U$1.EP2 89.92,16.76 88.32,18.36 88.32,27.25 87.38,27.94 84.07,27.94 82.8,29.21 82.8,46.99 82.04,47.75 79.5,47.75 78.74,48.51 IC2.12
A08_L
  Bottom 0.254: IC3.20 90.17,45.47 91.44,44.2 91.44,37.59 | U$1.EN2 93.04,16.18 91.44,17.27 91.44,37.59 | 91.44,37.59 91.44,38.1
A09_L  (via drill 0.61)
  Top 0.254: U$1.ER1 86.87,13.72 86.87,19.3 87.88,20.57 v92.5,20.57
  Bottom 0.254: IC3.19 92.71,45.47 93.98,44.2 93.98,41.66 92.71,40.39 92.71,21.08 arc-8 v92.5,20.57
A10_L  (via drill 0.61)
  Top 0.254: U$1.EP1 89.84,16.69 90.93,18.29 v93.98,18.29
  Bottom 0.254: IC3.18 95.25,45.47 96.52,44.2 96.52,41.91 95,40.39 93.98,40.39 93.47,39.88 93.47,21.59 93.98,20.57 v93.98,18.29
A11_L  (via drill 0.61)
  Top 0.254: U$1.EL1 99.57,13.21 v99.57,18.27
  Bottom 0.254: IC3.17 97.79,45.47 99.06,44.2 99.06,39.62 100.58,38.61 101.6,38.1 101.6,19.81 99.57,18.29 v99.57,18.27
A12_L  (via drill 0.61)
  Top 0.254: U$1.EC1 121.61,16.06 v123.44,17.02 | v123.44,40.13 105.66,40.13 105.16,39.12 v104.14,39.12
  Bottom 0.254: IC3.15 102.87,45.47 104.14,44.2 v104.14,39.12 | v123.44,17.02 v123.44,40.13
A13_L
  Bottom 0.254: IC3.14 105.41,45.47 106.68,44.2 106.68,39.62 105.41,38.1 104.14,36.83 104.14,24.13 102.56,22.56 U$1.EK2
A14_L  (via drill 0.3, 0.61)
  Top 0.254: U$1.EK1 102.56,16.21 103.63,17.27 103.63,18.8 104.65,19.81 111.76,19.81 114.81,22.86 120.4,22.86 v121.41,23.88 | v109.22,38.61 110.24,39.62 120.4,39.62 v121.41,38.1
  Bottom 0.254: IC3.13 107.95,45.47 109.22,44.2 v109.22,38.61 | v121.41,23.88 v121.41,38.1
A15_L
  Bottom 0.254: IC3.12 110.49,45.47 111.76,44.2 111.76,38.61 112.27,38.1 116.84,38.1 118.42,36.53 U$1.ED2
A16_L  (via drill 0.3, 0.61)
  Top 0.254: IC4.20 163.07,34.8 124.71,34.8 v122.43,32 | v122.43,22.61 121.16,21.34 v115.82,21.34
  Bottom 0.254: U$1.EE2 115.24,20.75 v115.82,21.34 | v122.43,22.61 v122.43,32
A17_L  (via drill 0.3)
  Top 0.254: U$1.ED1 118.42,16.82 119.38,18.8 122.68,18.8 v124.71,20.83 | IC4.19 166.37,33.53 164.34,33.53 162.81,33.78 125.48,33.78 v124.71,32
  Bottom 0.254: v124.71,20.83 v124.71,32
B_BBSY_IN  (via drill 0.3)
  Top 0.254: v159,100.84 IC12.41 | v124.21,89.41 123.7,88.9 119.63,88.9 IC1.83 110.94,88.84 98.81,76.71 44.96,76.71 44.2,75.69 44.2,54.36 45.72,53.09 45.72,48.26 44.96,47.75 34.8,47.75 34.29,47.24 IC9.3 34.29,42.93
  Bottom 0.254: v159,100.84 158.24,101.09 150.62,101.09 150.37,101.35 149.61,101.35 149.35,101.6 134.37,101.6 132.33,99.57 132.33,93.73 130.3,92.2 124.97,92.2 124.21,91.44 v124.21,89.41
B_BBSY_OUT
  Top 0.254: IC1.82 110.68,89.34 98.55,77.22 43.94,77.22 43.18,76.2 43.18,49.02 42.67,48.51 32.51,48.51 31.75,47.75 IC9.2
B_BG4_IN  (via drill 0.61)
  Top 0.254: IC1.5 145.43,78.34 146.3,77.47 165.35,77.47 v166.12,76.2
  Bottom 0.254: IC7.2 167.64,44.2 166.12,45.47 v166.12,76.2
B_BG4_OUT  (via drill 0.3)
  Top 0.254: IC1.6 145.95,78.84 v147.32,78.49
  Bottom 0.254: IC8.6 146.05,46.23 147.32,47.24 v147.32,78.49
B_BG5_IN  (via drill 0.61)
  Top 0.254: IC1.7 148.24,79.34 149.35,78.23 168.15,78.23 v168.91,77.72
  Bottom 0.254: IC7.3 170.18,44.2 168.91,45.47 v168.91,77.72
B_BG5_OUT  (via drill 0.61)
  Top 0.254: IC1.8 149.27,79.84 v149.86,79.25
  Bottom 0.254: IC8.7 148.59,45.72 149.86,46.99 v149.86,79.25
B_BR4_OUT  (via drill 0.3)
  Top 0.254: IC1.81 123.11,89.84 123.44,90.42 128.78,90.42 v131.57,86.87
  Bottom 0.254: IC8.2 135.89,46.23 137.16,47.5 137.16,61.21 135.64,62.74 135.64,87.38 135.13,87.88 132.84,87.88 v131.57,86.87
B_BR5_OUT  (via drill 0.3)
  Top 0.254: IC1.80 122.85,90.34 123.19,90.93 129.54,90.93 v131.57,88.39
  Bottom 0.254: IC8.3 138.43,45.97 139.7,47.24 139.7,59.44 136.14,62.99 136.14,87.88 135.38,88.65 132.08,88.65 v131.57,88.39
B_C0_IN  (via drill 0.3, 0.61)
  Top 0.254: IC10.13 102.87,39.88 103.63,40.64 119.38,40.64 120.4,41.66 v120.4,44.7 | IC1.100 116.66,80.34 115.32,79.5 v115.32,78.23
  Bottom 0.254: v120.4,44.7 120.4,66.29 115.32,71.12 v115.32,78.23
B_C0_OUT  (via drill 0.3, 0.61)
  Top 0.254: IC10.14 100.33,39.37 102.11,41.15 116.33,41.15 v117.35,42.16 | IC1.1 141.34,76.34 142.24,75.44 v142.24,69.34 | v117.35,56.13 140.46,56.13 142.75,58.42 v143.51,58.42
  Bottom 0.254: v117.35,42.16 v117.35,56.13 | v142.24,69.34 142.24,62.74 143.51,61.72 v143.51,58.42
B_C1_IN  (via drill 0.3, 0.61)
  Top 0.254: IC1.99 116.4,80.84 114.3,79.5 v114.3,76.2 | IC10.10 110.49,35.31 111.76,36.58 117.35,36.58 v118.87,38.1
  Bottom 0.254: v114.3,76.2 114.3,70.61 118.87,66.04 v118.87,38.1
B_C1_OUT  (via drill 0.3)
  Top 0.254: IC1.2 143.89,76.84 144.78,75.95 v144.78,69.09 | IC10.11 109.22,32.51 111.25,32.51 111.76,33.02 111.76,35.56 112.27,36.07 123.95,36.07 | 123.95,36.07 123.95,36.58 | 123.95,36.07 v142.24,36.07
  Bottom 0.254: v144.78,69.09 144.78,47.5 142.24,45.72 v142.24,36.07
B_INIT_IN  (via drill 0.3, 0.61)
  Top 0.254: IC1.84 129.08,88.34 130.3,87.12 v130.3,85.34 | v133.6,59.44 v163.07,59.44
  Bottom 0.254: v130.3,85.34 130.3,60.96 v133.6,59.44 | v163.07,59.44 163.07,44.45 IC7.1
B_INTR_OUT  (via drill 0.3)
  Top 0.254: v134.62,86.61 134.62,89.92 132.08,92.46 122.17,92.46 120.79,93.84 IC1.72
  Bottom 0.254: IC8.1 133.35,46.48 134.62,47.75 v134.62,86.61
B_MSYN_IN  (via drill 0.3, 0.61)
  Top 0.254: IC12.37 156.97,101.6 v156.97,100.33 | v124.97,87.38 118.87,87.38 IC1.86 117.57,87.34 117.09,86.87 109.73,86.87 99.06,76.2 46.23,76.2 45.47,75.18 v45.47,55.88
  Bottom 0.254: v156.97,100.33 156.46,100.58 150.37,100.58 150.11,100.84 149.35,100.84 149.1,101.09 134.62,101.09 132.84,99.31 132.84,93.47 130.56,91.69 125.73,91.69 125.22,91.19 125.22,87.63 v124.97,87.38 | v45.47,55.88 37.85,55.88 36.83,54.86 IC9.13
B_MSYN_OUT
  Top 0.254: IC1.74 117.99,93.34 117.86,93.47 117.86,95.25 116.84,96.27 111.25,96.27 110.24,95.25 110.24,91.19 97.79,78.74 36.32,78.74 34.29,76.71 IC9.14
B_NPG_IN  (via drill 0.61)
  Top 0.254: IC1.9 170.1,80.34 171.45,78.99 v171.45,78.74
  Bottom 0.254: IC7.4 172.72,44.2 171.45,45.47 v171.45,78.74
B_NPG_OUT  (via drill 0.61)
  Top 0.254: IC1.10 151.06,80.84 v152.4,81.53
  Bottom 0.254: IC8.8 151.13,45.47 152.4,46.74 v152.4,81.53
B_NPR_OUT  (via drill 0.3)
  Top 0.254: IC1.77 130.16,91.84 v132.33,89.66
  Bottom 0.254: IC8.4 140.97,47.24 142.24,48.51 142.24,61.47 141.48,62.23 137.67,62.23 136.65,63.25 136.65,88.65 135.89,89.41 132.59,89.41 v132.33,89.66
B_PA_IN
  Top 0.254: IC1.96 115.61,82.34 115.06,82.04 107.95,82.04 100.08,74.17 51.56,74.17 50.8,73.15 50.8,53.09 53.09,50.8 53.09,42.42 68.83,24.89 96.27,24.89 96.52,25.15 96.52,27.69 97.03,28.45 99.82,28.45 100.33,27.43 IC10.3
B_PA_OUT
  Top 0.254: IC1.93 117.58,83.84 116.84,85.09 109.47,85.09 99.57,75.18 49.78,75.18 48.77,74.17 48.77,54.1 52.32,50.55 52.32,41.66 54.36,39.37 67.82,24.13 97.03,24.13 97.79,25.91 IC10.2
B_PB_IN  (via drill 0.3)
  Top 0.254: IC1.97 115.88,81.84 115.32,81.53 108.97,81.53 v108.46,81.03 | IC10.6 107.95,27.18 109.22,28.45 110.24,28.45 111.51,29.46 115.32,29.46 116.33,30.73 116.33,31.75 115.32,32.77 113.79,32.77 112.52,32 85.6,32 84.84,32.77 84.84,56.64 85.34,57.15 88.14,57.15 88.9,57.91 88.9,65.28 89.66,66.04 107.95,66.04 v108.46,65.53
  Bottom 0.254: v108.46,65.53 v108.46,81.03
B_PB_OUT  (via drill 0.3)
  Top 0.254: IC1.94 117.38,83.34 116.59,84.58 110.24,84.58 v109.73,84.07 | IC10.5 107.95,28.96 109.98,28.96 111.25,29.97 115.06,29.97 115.82,30.99 115.82,31.5 115.06,32.26 114.05,32.26 112.78,31.5 84.58,31.5 83.82,32.26 83.82,57.15 84.33,57.66 87.88,57.66 88.39,58.17 88.39,65.79 89.15,66.55 109.47,66.55 v109.73,66.29
  Bottom 0.254: v109.73,66.29 v109.73,84.07
B_SACK_IN
  Top 0.254: IC1.87 117.83,86.84 117.09,86.11 109.73,86.11 99.31,75.69 47.5,75.69 46.74,74.68 46.74,54.1 48.26,52.58 48.26,48.01 47.24,46.99 42.93,46.99 41.91,45.97 IC9.6
B_SACK_OUT  (via drill 0.61)
  Top 0.254: IC1.78 115.98,91.34 115.32,90.68 110.49,90.68 98.04,78.23 40.89,78.23 39.37,76.45 v39.37,54.36
  Bottom 0.254: v39.37,54.36 38.1,53.09 38.1,44.45 IC9.5
B_SSYN_IN  (via drill 0.3, 0.61)
  Top 0.254: IC12.38 157.48,101.6 157.48,101.09 157.73,100.58 157.73,100.08 v156.97,99.06 | v126.75,86.11 122.94,86.11 120.4,81.28 119.63,81.28 IC1.98 116.14,81.34 112.78,79.25 106.68,79.25 100.58,73.15 53.34,73.15 52.58,72.14 v52.58,55.88
  Bottom 0.254: v156.97,99.06 154.94,99.06 153.92,100.08 150.11,100.08 149.86,100.33 149.1,100.33 148.84,100.58 135.13,100.58 133.35,99.06 133.35,93.22 130.81,91.19 127.25,91.19 126.75,90.68 v126.75,86.11 | v52.58,55.88 47.5,55.88 44.45,52.83 IC9.10 44.45,50.55
B_SSYN_OUT
  Top 0.254: IC1.79 116.24,90.84 115.32,89.92 110.49,89.92 98.3,77.72 42.93,77.72 41.91,76.45 IC9.11 41.91,50.55
BBSY_L
  Top 0.254: U$1.FD1 48.56,34.49 46.74,36.07 30.48,36.07 29.21,37.85 IC9.1
  Top 0.406: IC9.1 29.21,43.43
BG4_IN  (via drill 0.3, 0.6)
  Top 0.254: v148.34,18.8 v151.51,18.8 | 165.61,61.98 R37.1
  Top 0.406: 165.61,61.98 165.86,59.94 v167.64,59.44 165.86,58.93 R38.2
  Bottom 0.254: U$1.DS2 147.01,13.01 146.81,13.21 146.81,17.27 v148.34,18.8 | v151.51,18.8 168.15,18.8 168.91,19.56 168.91,44.2 167.64,45.47 IC7.19 v167.64,59.44
BG4_OUT
  Top 0.254: R34.1 147.07,53.85 IC8.15
  Bottom 0.254: IC8.15 146.05,47.24 144.78,46.23 144.78,36.58 143.76,35.56 143.76,13.21 143.84,13.13 U$1.DT2
BG5_IN  (via drill 0.6)
  Top 0.254: 170.43,61.72 R39.1
  Top 0.406: 170.43,61.72 v170.18,59.44 R40.2
  Bottom 0.254: U$1.DP2 153.34,12.12 153.42,12.19 153.42,16.76 154.43,17.78 169.67,17.78 170.69,18.8 170.69,22.86 171.45,23.88 171.45,44.2 170.18,45.47 IC7.18 v170.18,59.44
BG5_OUT
  Top 0.254: R35.1 150.37,53.85 IC8.14
  Bottom 0.254: IC8.14 148.59,47.24 147.32,45.97 147.32,38.1 149.86,34.54 149.86,12.19 150.19,11.86 U$1.DR2
BR4_L  (via drill 0.61)
  Top 0.254: v139.7,21.84 v172.21,21.84
  Bottom 0.254: U$1.DH2 172.39,21.67 v172.21,21.84 | v139.7,21.84 139.7,37.08 134.62,42.16 134.62,46.74 135.64,47.75 135.64,50.29 IC8.19
BR5_L  (via drill 0.61)
  Top 0.254: v140.97,23.37 v174.24,23.37
  Bottom 0.254: U$1.DF2 175.54,21.57 v174.24,23.37 | IC8.18 138.43,47.5 137.16,46.23 137.16,41.91 140.97,38.1 v140.97,23.37
BUS_ADDR0
  Top 0.254: IC1.112 122.3,73.53 121.67,73.15 112.52,73.15 110.74,71.37 58.67,71.37 57.15,69.85 57.15,44.96 IC2.1
BUS_ADDR1
  Top 0.254: IC1.113 122.81,73.41 122.68,73.15 121.92,72.64 112.78,72.64 111,70.87 61.21,70.87 59.69,69.34 59.69,46.23 60.96,44.96 IC2.2
BUS_ADDR2
  Top 0.254: IC1.114 123.32,73.91 123.19,72.9 122.17,72.14 113.28,72.14 111.25,70.1 62.99,70.1 62.23,69.34 62.23,46.23 63.5,44.96 IC2.3 63.5,42.93
BUS_ADDR3
  Top 0.254: IC1.116 124.21,72.39 124.21,70.1 123.19,69.34 65.79,69.34 64.77,68.33 64.77,46.23 66.04,44.96 IC2.4
BUS_ADDR4
  Top 0.254: IC1.117 124.71,72.9 124.71,69.85 123.44,68.83 70.61,68.83 69.85,68.33 69.85,44.45 IC2.6
BUS_ADDR5
  Top 0.254: IC1.118 125.22,72.64 125.22,69.6 123.7,68.33 73.41,68.33 72.39,67.31 72.39,44.45 IC2.7
BUS_ADDR6
  Top 0.254: IC2.8 76.2,44.96 74.93,46.23 74.93,66.8 76.2,67.82 123.95,67.82 125.73,69.34 125.73,72.9 125.79,72.96 IC1.119
BUS_ADDR7
  Top 0.254: IC2.9 78.74,45.21 77.47,46.48 77.47,66.55 78.49,67.31 124.21,67.31 126.24,69.09 126.24,72.9 126.29,72.95 IC1.120
BUS_ADDR8
  Top 0.254: IC3.1 88.65,44.7 88.65,54.1 91.44,56.9 91.44,62.48 92.71,63.75 121.92,63.75 126.75,68.58 126.75,73.91 126.79,73.96 IC1.121
BUS_ADDR9
  Top 0.254: IC3.2 92.71,43.94 91.19,45.47 91.19,55.37 92.2,56.39 92.2,61.72 93.47,62.99 122.43,62.99 127.25,67.82 127.25,73.91 127.29,73.95 IC1.122
BUS_ADDR10
  Top 0.254: IC3.3 95.25,44.2 93.98,45.47 93.98,60.96 95.25,62.23 129.79,62.23 131.83,64.01 131.83,66.55 132.21,67.18 132.21,72.26 131.83,72.9 131.83,73.91 131.79,73.95 IC1.131
BUS_ADDR11
  Top 0.254: IC3.4 97.79,44.2 96.52,45.47 96.52,59.94 98.04,61.47 130.05,61.47 132.33,63.75 132.33,66.42 132.72,67.06 132.72,72.64 132.33,73.15 132.33,73.91 132.29,73.96 IC1.132
BUS_ADDR12
  Top 0.254: IC3.6 102.87,43.43 101.6,44.7 101.6,59.18 102.87,60.45 130.05,60.45 132.84,63.25 132.84,66.17 133.22,66.93 133.22,72.9 132.84,73.41 132.79,73.97 IC1.133
BUS_ADDR13
  Top 0.254: IC3.7 105.41,44.2 104.14,45.47 104.14,57.91 105.92,59.69 130.3,59.69 133.48,62.99 133.48,66.04 133.73,66.8 133.73,73.15 133.35,73.53 133.29,73.97 IC1.134
BUS_ADDR14
  Top 0.254: IC3.8 107.95,44.2 106.68,45.47 106.68,57.4 108.2,58.93 130.56,58.93 134.11,62.48 134.11,65.91 134.24,66.42 134.24,73.28 134.29,74.24 IC1.136
BUS_ADDR15
  Top 0.254: IC3.9 110.49,44.2 109.22,45.47 109.22,56.9 110.24,57.91 130.56,57.91 134.75,62.23 134.75,73.15 134.79,73.62 IC1.137
BUS_ADDR16  (via drill 0.61)
  Top 0.254: IC1.138 135.29,63.85 136.65,62.48 v160.02,62.48
  Bottom 0.254: IC4.1 160.78,27.94 160.02,28.45 v160.02,62.48
BUS_ADDR17  (via drill 0.61)
  Top 0.254: IC1.139 135.79,65.12 137.41,63.75 v161.54,63.75 | IC4.2 167.64,30.48 167.13,30.99 v161.54,30.99
  Bottom 0.254: v161.54,30.99 v161.54,63.75
BUS_ADDR_DIR  (via drill 0.3, 0.61)
  Top 0.254: IC3.11 v127.51,50.8 | v138.18,32.51 173.23,32.51 | 173.23,32.51 173.74,32.51 | 173.23,32.51 186.94,32.51 187.96,33.53 IC4.11 | IC1.111 121.79,75.56 122.43,76.2 v124.21,76.2 | 81.28,50.55 IC2.11 R13.2
  Bottom 0.254: v138.18,32.51 138.18,36.58 133.6,41.15 131.83,41.15 v127.51,50.8 127.51,52.83 124.21,56.13 v124.21,76.2 | IC2.11 83.06,52.58 112.27,52.58 113.03,51.82 IC3.11
BUS_DATA0
  Top 0.254: IC1.18 141.98,84.84 143,83.82 155.45,83.82 156.46,82.8 184.66,82.8 203.2,64.26 203.2,29.46 204.72,27.94 IC5.1
BUS_DATA1
  Top 0.254: IC1.19 142.24,85.34 143.26,84.33 155.7,84.33 156.72,83.31 184.91,83.31 205.87,62.36 205.74,29.46 IC5.2
BUS_DATA2
  Top 0.254: IC1.21 142.01,86.34 143.51,84.84 155.96,84.84 156.97,83.82 185.17,83.82 194.82,74.17 | 194.82,74.17 195.07,73.91 | 194.82,74.17 208.28,60.71 208.28,29.46 IC5.3
BUS_DATA3
  Top 0.254: IC1.22 142.27,86.84 143.76,85.34 156.21,85.34 157.23,84.33 185.42,84.33 210.82,58.93 210.82,29.46 212.34,27.94 IC5.4
BUS_DATA4
  Top 0.254: IC1.23 142.53,87.34 144.02,85.85 156.46,85.85 157.48,84.84 185.67,84.84 216.66,53.85 216.66,37.85 215.9,37.34 215.9,29.46 217.17,28.19 IC5.6
BUS_DATA5
  Top 0.254: IC1.25 154.74,88.34 157.73,85.34 185.93,85.34 218.44,52.83 218.44,29.46 IC5.7
BUS_DATA6
  Top 0.254: IC1.26 155,88.84 157.99,85.85 186.18,85.85 220.98,51.05 220.98,29.46 IC5.8
BUS_DATA7
  Top 0.254: IC1.27 155.26,89.34 158.24,86.36 186.44,86.36 223.52,49.28 223.52,38.35 | IC5.9 224.54,27.94 223.52,29.46 223.52,38.35 | 223.52,38.35 223.52,38.61
BUS_DATA8
  Top 0.254: IC1.28 155.52,89.84 158.5,86.87 186.69,86.87 234.95,38.61 234.95,29.21 IC6.1
BUS_DATA9
  Top 0.254: IC1.29 155.79,90.34 158.75,87.38 186.94,87.38 236.47,37.85 236.98,37.85 237.49,37.34 237.49,29.21 IC6.2
BUS_DATA10
  Top 0.254: IC1.30 156.05,90.84 159,87.88 187.2,87.88 235.97,39.12 238.25,39.12 240.03,37.34 240.03,29.21 IC6.3
BUS_DATA11
  Top 0.254: IC1.31 156.31,91.34 159.26,88.39 187.45,88.39 235.97,39.88 240.03,39.88 242.57,37.34 242.57,29.21 IC6.4
BUS_DATA12
  Top 0.254: IC1.32 156.57,91.84 159.51,88.9 187.71,88.9 235.97,40.64 241.81,40.64 245.11,37.34 245.11,31.75 IC6.6
BUS_DATA13
  Top 0.254: IC1.34 156.33,92.84 159.77,89.41 187.96,89.41 234.44,42.93 248.16,42.93 250.19,40.89 250.19,29.21 IC6.7
BUS_DATA14
  Top 0.254: IC1.35 156.6,93.34 160.02,89.92 188.21,89.92 234.44,43.69 250.44,43.69 252.73,41.4 252.73,29.21 IC6.8
BUS_DATA15
  Top 0.254: IC1.36 156.86,93.84 160.27,90.42 188.47,90.42 234.44,44.45 251.71,44.45 255.27,40.89 255.27,28.96 IC6.9
BUS_DATA_DIR  (via drill 0.3)
  Top 0.254: IC1.16 142.22,83.84 142.75,83.31 155.19,83.31 156.21,82.3 184.4,82.3 201.68,65.02 v201.68,42.67 201.68,41.4 200.66,40.39 | 200.66,40.39 199.9,39.62 | 200.66,40.39 R14.2
  Bottom 0.254: v201.68,42.67 226.57,42.67 227.33,41.91 IC5.11 228.35,37.59 257.81,37.59 IC6.11
C0_L  (via drill 0.61)
  Top 0.254: v104.65,20.83 v99.06,20.83
  Bottom 0.254: U$1.EJ2 105.74,16.18 104.65,17.27 v104.65,20.83 | IC10.15 97.79,29.97 99.06,28.7 v99.06,20.83
C1_L
  Bottom 0.254: U$1.EF2 112.04,25.12 111.76,25.4 111.76,30.48 110.49,31.75 106.68,31.75 105.41,33.02 IC10.12
CF_CS0#  (via drill 0.3)
  Top 0.254: IC1.143 137.79,67.19 138.18,66.8 194.06,66.8 194.31,67.06 v194.31,67.31 | X2.7 240.35,78.3 237.74,75.95 236.85,75.06 236.85,64.77 236.09,64.01 219.2,64.01 216.79,66.42 216.79,72.39 217.81,73.41 217.82,73.39 JP3.37
  Bottom 0.254: v194.31,67.31 196.85,67.31 197.36,66.8 215.39,66.8 216.79,68.33 216.79,72.39 217.92,73.39 | 217.92,73.39 217.93,73.41 | 217.92,73.39 JP3.37
CF_CS1#  (via drill 0.3)
  Top 0.254: IC1.142 137.29,66.93 137.92,66.29 v195.83,66.29 | X2.32 239.71,78.8 234.82,73.91 234.82,70.23 234.95,70.1 234.95,65.02 234.31,64.64 219.84,64.64 217.93,66.8 217.93,71.37 JP3.38
  Bottom 0.254: v195.83,66.29 216.41,66.29 217.93,68.07 217.93,71.12 217.87,71.44 JP3.38
CF_INTR
  Top 0.254: X2.37 233.36,79.95 232.92,79.5 227.58,79.5 224.03,75.95 224.03,73.41 224.01,73.39 JP3.31
CF_IORD#  (via drill 0.3)
  Top 0.254: IC1.140 136.29,66.15 137.16,65.28 194.06,65.28 195.07,64.26 v198.88,64.26 | X2.34 237.17,80.2 234.7,77.72 231.65,77.72 230.12,76.2 230.12,73.66 229.85,73.39 | 229.85,73.39 229.62,73.15 | JP3.25 229.85,73.39
  Bottom 0.254: v198.88,64.26 199.39,64.26 200.15,65.28 226.82,65.28 227.58,66.04 227.58,69.6 228.85,70.87 228.85,72.39 229.87,73.41 JP3.25
CF_IOWR#  (via drill 0.3)
  Top 0.254: IC1.141 136.79,66.66 137.67,65.79 194.56,65.79 195.07,65.28 v197.61,65.28 | X2.35 235.9,79.95 234.19,78.23 231.39,78.23 228.85,75.69 228.85,72.9 229.36,72.39 230.89,72.39 231.89,73.39 | 231.89,73.39 231.9,73.41 | JP3.23 231.89,73.39
  Bottom 0.254: v197.61,65.28 199.14,65.28 199.64,65.79 226.06,65.79 226.82,66.55 226.82,71.88 227.33,72.39 228.09,72.39 228.85,73.15 228.85,74.17 229.36,74.68 230.63,74.68 231.9,73.41 231.89,73.39 JP3.23
CF_RESET_N  (via drill 0.3 pad 0.3)
  Top 0.254: 254,81.53 J5.2 251.71,78.99 v247.14,78.99 | X2.41 228.28,81.6 v228.35,81.53
  Bottom 0.254: v228.35,81.53 238.51,81.53 241.05,78.99 v247.14,78.99
CPLD_CLK
  Top 0.254: IC12.52 163.61,105.7 162.81,104.9 162.81,104.14 163.07,103.38 163.07,101.85 164.08,100.58 164.08,94.49 162.81,93.47 159.26,93.47 157.73,94.49 138.94,94.49 136.65,93.22 136.65,78.49 136.14,77.98 130.81,77.98 130.3,77.47 130.3,74.42 130.29,74.41 IC1.128
CPU_A0  (via drill 0.3, 0.61)
  Top 0.254: IC1.60 126.79,96.98 126.75,97.03 126.75,104.39 133.6,111 136.4,113.54 152.65,113.54 153.8,112.14 154.69,111 158.24,111 v159,112.01 158.5,112.27 158.5,113.54 IC12.9 | v223.27,112.78 223.27,91.44 223.77,90.42 223.77,89.66 223.84,89.47 X2.20 223.84,78.04 219.96,74.17 219.96,73.41 219.95,73.39 JP3.35
  Bottom 0.254: v159,112.01 160.53,112.01 161.8,112.78 v223.27,112.78
CPU_A1  (via drill 0.3 pad 0.3, 0.61)
  Top 0.254: IC1.61 126.29,104.83 136.02,114.05 152.91,114.05 153.67,113.03 154.94,111.51 157.48,111.51 157.99,112.27 157.99,113.54 158,113.55 IC12.10 158,117.84 v157.73,118.11 | 225.04,120.9 225.04,92.46 225.55,91.95 225.55,90.68 225.11,90.23 X2.19 225.11,78.55 221.74,75.18 221.74,73.66 222,73.41 221.98,73.39 JP3.33 | 225.04,120.9 225.04,121.16 | v225.04,122.43 225.04,120.9
  Bottom 0.254: v157.73,118.11 159.26,122.43 v225.04,122.43
CPU_A2  (via drill 0.3, 0.61)
  Top 0.254: IC1.62 125.79,105.22 135.64,114.55 154.18,114.55 154.43,114.3 154.43,113.03 154.69,112.78 155.96,112.78 v156.46,112.27 156.46,113.54 156.5,113.57 IC12.13 | v226.52,123.49 226.31,122.17 226.31,89.92 226.38,89.85 X2.18 226.38,79.06 222.76,75.44 222.76,70.1 222.25,69.6 220.47,69.6 219.96,70.1 219.96,71.37 219.95,71.39 JP3.36
  Bottom 0.254: v156.46,112.27 155.96,112.78 155.96,118.62 158.24,123.44 v226.52,123.49
CPU_A3
  Top 0.254: IC1.63 125.29,105.61 135.38,115.06 154.69,115.06 154.94,114.81 154.94,113.54 155,113.6 IC12.16
CPU_D0  (via drill 0.3, 0.3 pad 0.3)
  Top 0.254: IC1.37 138.29,95.87 138.43,95.76 139.7,95.25 v147.83,95.25 157.73,95.25 159.51,94.23 162.56,94.23 163.58,95 163.58,100.33 162.5,101.66 IC12.48 | X2.21 222.5,85.85 222.5,77.98 v221.23,76.96
  Bottom 0.254: v147.83,95.25 152.4,95.25 158.75,88.9 188.47,88.9 216.66,80.01 218.95,76.96 v221.23,76.96 237.24,76.96 238,76.2 238,73.66 237.87,73.79 JP3.17
CPU_D1  (via drill 0.3, 0.3 pad 0.3)
  Top 0.254: IC1.38 137.79,96.64 138.94,97.03 139.7,96.01 v149.1,96.01 157.99,96.01 159.77,95 162.05,95 163.07,95.76 163.07,100.08 162,101.4 IC12.47 | X2.22 221.23,81.28 221.23,79.25 v220.98,78.49
  Bottom 0.254: v149.1,96.01 152.4,96.01 158.75,89.66 188.72,89.66 216.66,81.03 218.95,78.49 v220.98,78.49 | v220.98,78.49 221.23,78.49 | JP3.15 239.87,76.36 237.74,78.49 v220.98,78.49
CPU_D2  (via drill 0.3, 0.3 pad 0.3)
  Top 0.254: IC1.39 137.29,96.9 138.94,97.79 139.95,96.77 v147.83,96.77 159.51,96.77 160.27,98.04 160.27,100.58 160.5,101.06 IC12.44 | X2.23 219.96,85.85 219.96,80.77 v219.71,80.26
  Bottom 0.254: v147.83,96.77 152.4,96.77 158.75,90.42 188.98,90.42 216.92,82.04 218.69,80.26 v219.71,80.26 | v219.71,80.26 219.96,80.26 | JP3.13 241.87,75.38 236.98,80.26 v219.71,80.26
CPU_D3  (via drill 0.3, 0.3 pad 0.3)
  Top 0.254: IC1.40 136.79,97.17 138.94,98.55 139.95,97.54 v149.1,97.54 159,97.54 159.77,98.81 159.77,100.84 160,101.37 IC12.43 | X2.2 246.76,86.11 246.76,85.47 246.89,85.34 v246.89,80.52
  Bottom 0.254: v149.1,97.54 152.4,97.54 158.75,91.19 189.23,91.19 216.92,83.06 239.01,83.06 241.3,80.52 v246.89,80.52 247.65,80.52 248.16,80.01 248.16,77.98 246.89,76.71 246.89,72.9 246.38,72.39 244.86,72.39 243.86,73.39 | 243.86,73.39 JP3.11 | 243.86,73.39 243.84,73.41
CPU_D4  (via drill 0.3, 0.3 pad 0.3)
  Top 0.254: IC1.41 136.29,97.43 138.94,99.31 139.95,98.3 v147.83,98.3 155.19,98.3 156.5,101.13 IC12.36 | X2.3 245.36,85.85 v245.36,81.53 245.36,74.93 245.87,74.42 JP3.9
  Bottom 0.254: v147.83,98.3 152.4,98.3 158.75,91.95 189.99,91.95 216.92,83.82 239.78,83.82 241.81,81.53 v245.36,81.53
CPU_D5  (via drill 0.3, 0.3 pad 0.3)
  Top 0.254: IC1.42 135.79,97.69 138.94,100.08 139.95,99.06 148.59,99.06 | 148.59,99.06 v149.1,99.06 | IC12.35 156,101.39 154.69,99.06 148.59,99.06 | X2.4 244.09,85.85 244.09,83.31 243.84,83.06 v243.84,82.55
  Bottom 0.254: v149.1,99.06 152.4,99.06 158.75,92.71 190.75,92.71 216.92,84.58 240.28,84.58 242.06,82.55 v243.84,82.55 247.27,82.55 248.92,81.41 248.92,74.68 JP3.7
CPU_D6  (via drill 0.3, 0.3 pad 0.3)
  Top 0.254: IC1.43 135.29,97.95 138.94,100.84 139.95,99.82 v147.83,99.82 154.43,99.82 155.5,101.65 IC12.34 | X2.5 242.82,86.11 v242.82,84.07
  Bottom 0.254: v147.83,99.82 149.61,99.82 149.86,99.57 152.65,99.57 158.75,93.47 190.75,93.47 216.92,85.34 241.55,85.34 v242.82,84.07 247.27,84.07 249.94,82.17 249.94,73.41 JP3.5
CPU_D7  (via drill 0.3, 0.3 pad 0.3, 0.61)
  Top 0.254: IC1.44 134.79,98.21 138.18,100.84 138.18,103.89 138.49,104.2 IC12.32 155.13,104.2 155.45,103.89 v156.46,103.89 | 241.56,102.11 241.55,101.35 241.55,90.17 241.62,90.11 X2.6 241.62,85.92 241.55,85.85 v241.55,76.96 | 241.56,102.11 241.55,102.36 | 241.55,102.11 | 241.55,102.11 241.56,102.11 | v241.55,103.12 241.55,102.11
  Bottom 0.254: v156.46,103.89 159.26,103.89 160.02,103.12 v241.55,103.12 | v241.55,76.96 242.82,75.95 242.82,70.61 243.59,69.85 250.44,69.85 250.95,70.61 250.95,72.14 251.71,73.41 251.97,73.41 251.95,73.39 JP3.3
CPU_D8  (via drill 0.3 pad 0.3, 0.61)
  Top 0.254: IC1.45 134.29,98.48 137.67,101.09 137.67,104.39 137.97,104.7 IC12.31 157.79,104.7 158.24,104.39 159,103.63 160.53,103.63 v160.78,103.89 | X2.47 220.73,90.17 220.73,103.89 220.98,104.14 | v220.98,104.39 220.98,104.14 | JP3.4 251.87,63.15 250.7,61.72 218.19,61.72 205.99,73.91 205.99,107.7 206.76,108.46 220.22,108.46 220.98,107.7 220.98,104.14
  Bottom 0.254: v160.78,103.89 220.47,103.89 v220.98,104.39
CPU_D9  (via drill 0.3 pad 0.3, 0.61)
  Top 0.254: IC1.46 133.79,98.74 137.16,101.35 137.16,104.9 137.46,105.2 IC12.30 158.79,105.2 v159.51,104.65 | X2.48 219.46,89.92 219.46,102.36 | 219.46,102.36 219.46,102.62 | 219.46,102.36 219.46,105.16 219.71,105.41 v219.71,105.66 219.71,107.19 218.95,107.95 207.77,107.95 207.01,107.19 207.01,73.91 218.44,62.48 248.92,62.48 249.87,63.43 JP3.6
  Bottom 0.254: v159.51,104.65 218.69,104.65 v219.71,105.66
CPU_D10  (via drill 0.3 pad 0.3, 0.61)
  Top 0.254: IC1.47 133.29,99 136.65,101.6 136.65,105.41 136.94,105.7 IC12.29 157.52,105.7 v157.73,105.92 | X2.49 218.19,89.92 218.19,104.14 | 218.19,104.14 218.19,104.65 | 218.19,104.14 v218.19,106.68 217.68,107.19 208.53,107.19 208.03,106.68 208.03,73.91 218.69,63.25 247.14,63.25 247.87,63.97 JP3.8
  Bottom 0.254: v157.73,105.92 158.75,105.92 161.54,107.19 167.89,107.19 | 167.89,107.19 168.91,107.19 | 167.89,107.19 217.42,107.19 v218.19,106.68
CPU_D11  (via drill 0.3 pad 0.3, 0.61)
  Top 0.254: IC1.48 132.79,99.26 136.14,101.85 136.14,105.66 136.68,106.2 IC12.28 156.24,106.2 v156.72,106.68 | JP3.10 245.87,71.12 246.89,72.39 246.89,74.68 245.87,75.69 245.87,80.77 246.38,81.28 246.38,81.79 246.06,82.11 X2.27 246.06,89.98 246.13,90.42 246.12,105.92 246.13,105.92 v246.13,106.43
  Bottom 0.254: v156.72,106.68 159,106.68 161.54,107.7 242.32,107.7 243.08,106.43 v246.13,106.43
CPU_D12  (via drill 0.3 pad 0.3, 0.61)
  Top 0.254: IC1.49 132.29,99.52 135.64,102.11 135.64,105.92 136.42,106.7 IC12.27 154.71,106.7 v155.7,107.44 | 243.87,71.15 243.84,71.12 | 243.87,71.15 JP3.12 | 243.87,71.15 244.86,72.14 244.86,80.26 244.35,80.77 244.35,81.79 244.79,82.23 X2.28 244.79,89.85 244.86,89.92 244.86,105.92 244.85,106.68 244.86,106.68 v245.36,107.95
  Bottom 0.254: v155.7,107.44 159.51,107.44 161.54,108.2 242.82,108.2 243.08,107.95 v245.36,107.95
CPU_D13  (via drill 0.3 pad 0.3, 0.61)
  Top 0.254: IC1.53 130.29,96 130.3,96.01 130.3,105.41 134.35,109.2 IC12.22 154.96,109.2 155.7,108.46 158.5,108.46 v158.75,108.71 | v243.84,108.97 243.52,107.76 X2.29 243.52,83.5 242.82,83.06 242.82,81.28 243.59,80.77 243.59,75.18 242.82,74.68 242.82,72.14 241.87,71.18 | 241.87,71.18 241.81,71.12 | 241.87,71.18 JP3.14
  Bottom 0.254: v158.75,108.71 160.27,108.71 162.81,111.25 220.73,111.25 223.27,108.97 v243.84,108.97
CPU_D14  (via drill 0.3 pad 0.3, 0.61)
  Top 0.254: IC1.54 129.79,95.76 129.79,105.66 134.08,109.7 IC12.21 155.48,109.7 155.96,109.22 157.23,109.22 v157.48,109.47 | v242.06,110.24 242.06,104.65 242.82,104.14 242.82,101.85 242.32,101.35 X2.30 242.25,85.79 242.06,85.6 242.06,78.23 242.51,77.79 242.51,76.14 240.79,74.68 240.79,72.14 239.87,71.21 | 239.87,71.21 239.78,71.12 | 239.87,71.21 JP3.16
  Bottom 0.254: v157.48,109.47 160.27,109.47 162.56,111.76 221.23,111.76 223.27,110.24 v242.06,110.24
CPU_D15  (via drill 0.3 pad 0.3, 0.61)
  Top 0.254: IC1.55 129.29,96.01 129.29,105.92 133.82,110.2 IC12.20 156.17,110.2 v156.21,110.24 | v240.28,111.23 240.28,106.93 240.28,101.85 241.05,101.35 241.05,90.17 240.98,90.11 X2.31 240.98,77.92 238.76,75.69 238.76,72.14 237.87,71.25 | 237.87,71.25 237.74,71.12 | 237.87,71.25 JP3.18
  Bottom 0.254: v156.21,110.24 160.27,110.24 162.31,112.27 221.74,112.27 223.27,111.25 239.27,111.25 | 239.27,111.25 239.78,111.25 | v240.28,111.23 239.29,111.23 239.27,111.25
CPU_INT  (via drill 0.3)
  Top 0.254: IC1.67 123.29,107.16 123.44,107.44 v123.95,107.95 | IC12.25 v135.89,107.7
  Bottom 0.254: v135.89,107.7 134.87,107.95 v123.95,107.95
CPU_RD
  Top 0.254: IC1.65 124.29,105.49 135.13,115.57 155.19,115.57 155.45,115.32 155.5,115.01 IC12.15
CPU_WR  (via drill 0.3)
  Top 0.254: IC1.66 123.79,106.65 125.86,108.71 v125.98,108.71 | IC12.23 137.41,108.71 v137.16,108.46
  Bottom 0.254: v137.16,108.46 136.91,108.71 v125.98,108.71
D00_L
  Bottom 0.254: U$1.CS2 216.87,16.31 215.9,18.29 215.9,23.88 | IC5.20 204.47,32.77 205.23,32 207.77,32 208.28,32.51 208.28,37.08 208.79,37.59 212.85,37.59 213.36,37.08 213.36,33.53 215.9,32 215.9,23.88 | 215.9,23.88 215.9,23.37
D01_L
  Bottom 0.254: U$1.CR2 219.96,13.21 220.04,13.28 219.96,13.72 219.96,23.88 218.44,25.4 218.44,32 215.9,33.53 215.9,37.59 214.88,38.61 208.28,38.61 206.76,37.59 206.76,36.07 IC5.19
D02_L
  Bottom 0.254: U$1.CU2 210.46,13.06 210.31,13.21 210.31,24.89 210.82,25.4 210.82,32 209.55,33.02 IC5.18
D03_L
  Bottom 0.254: U$1.CT2 213.69,12.01 213.36,12.19 213.36,32 212.09,33.02 IC5.17
D04_L
  Bottom 0.254: U$1.CN2 226.39,13.03 226.57,13.21 226.57,24.89 226.06,25.4 226.06,30.99 223.52,33.53 223.52,36.83 222.25,38.1 218.44,38.1 217.17,36.83 IC5.15
D05_L
  Bottom 0.254: U$1.CP2 223.19,13.03 223.01,13.21 223.01,23.37 220.98,25.4 220.98,32 219.71,33.02 IC5.14
D06_L  (via drill 0.61)
  Top 0.254: v224.54,16.76 220.98,16.76 219.46,18.29 211.33,18.29 209.8,16.76 v208.28,16.76
  Bottom 0.254: IC5.13 222.25,30.48 223.52,29.21 223.52,25.4 224.54,24.38 v224.54,16.76 | U$1.CV2 207.4,15.38 v208.28,16.76
D07_L
  Bottom 0.254: U$1.CM2 229.54,13.64 229.62,13.72 229.62,32 228.6,33.02 226.06,33.02 224.79,34.29 IC5.12
D08_L
  Bottom 0.254: IC6.20 236.22,33.02 234.95,31.75 233.68,31.75 232.16,30.48 232.16,13.21 232.41,13.46 232.41,7.62 232.48,7.69 U$1.CL2
D09_L